# Altium project HU_revC.PrjPcb (part 3 of 4)

## Sheet MAX96724_PINOUT.SchDoc
size D; SheetNumber: 10; SheetTotal: 20
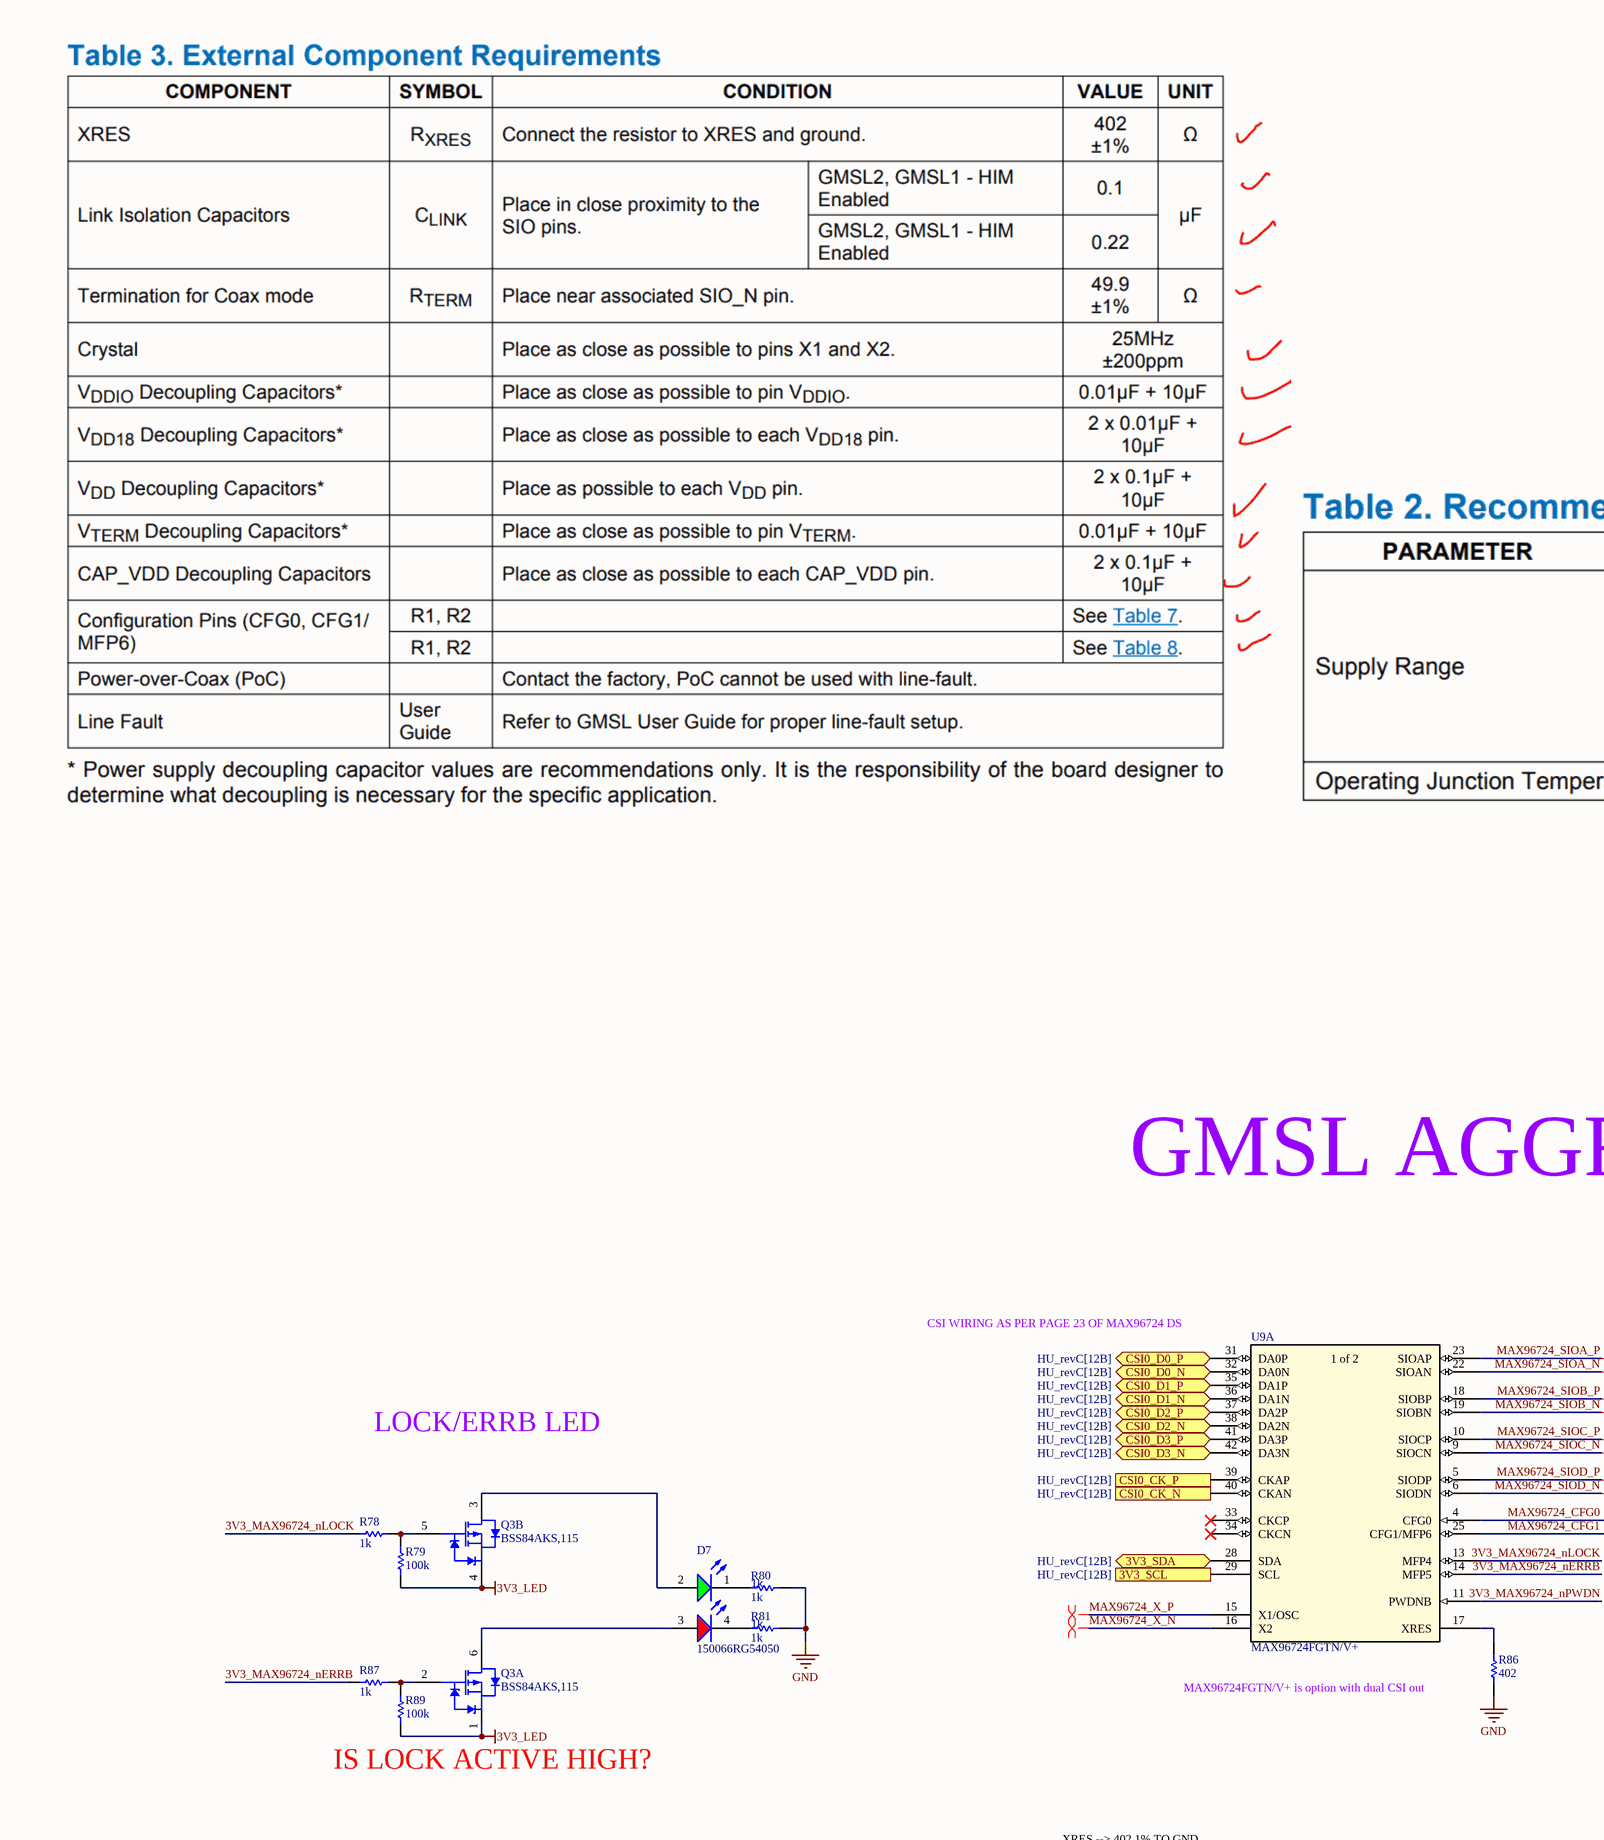
[diagram p13: MAX96724_PINOUT.SchDoc, top left]
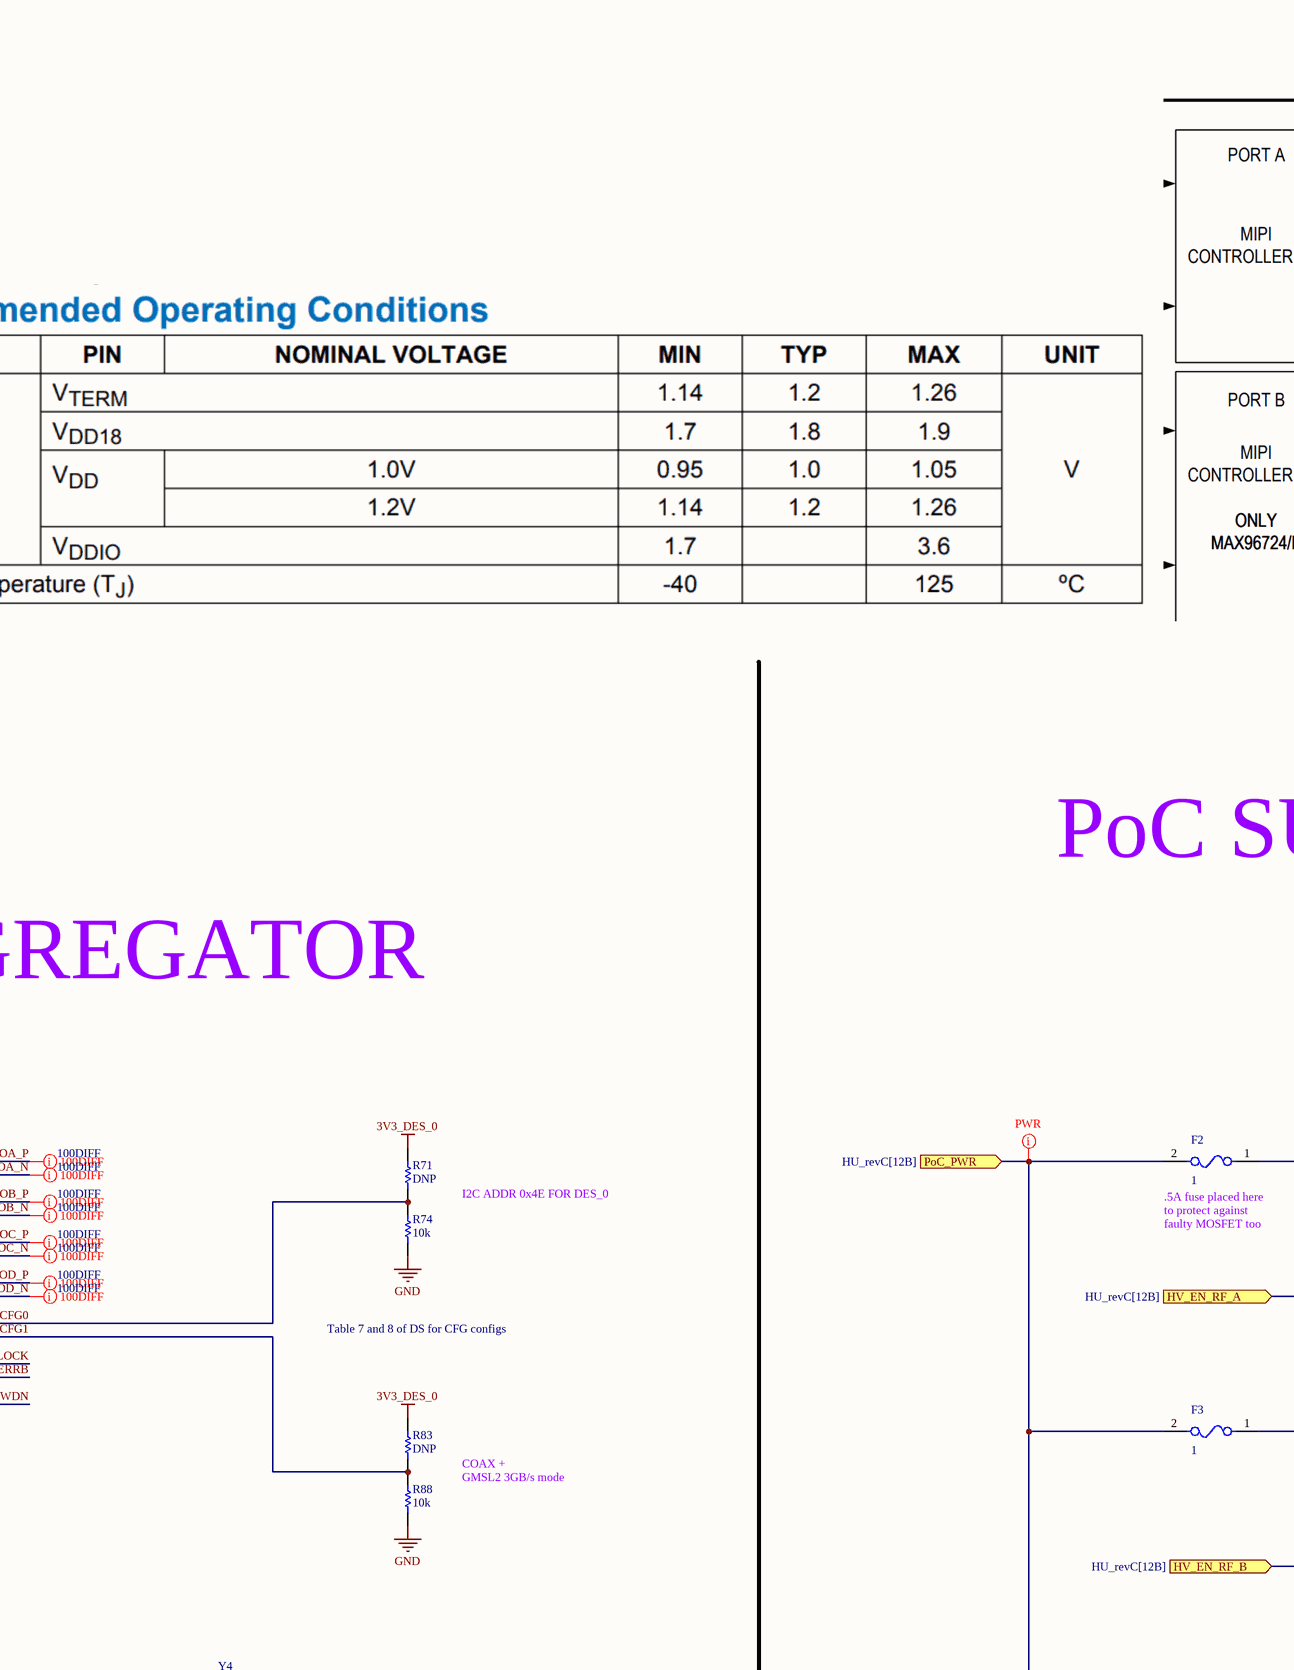
[diagram p14: MAX96724_PINOUT.SchDoc, top middle]
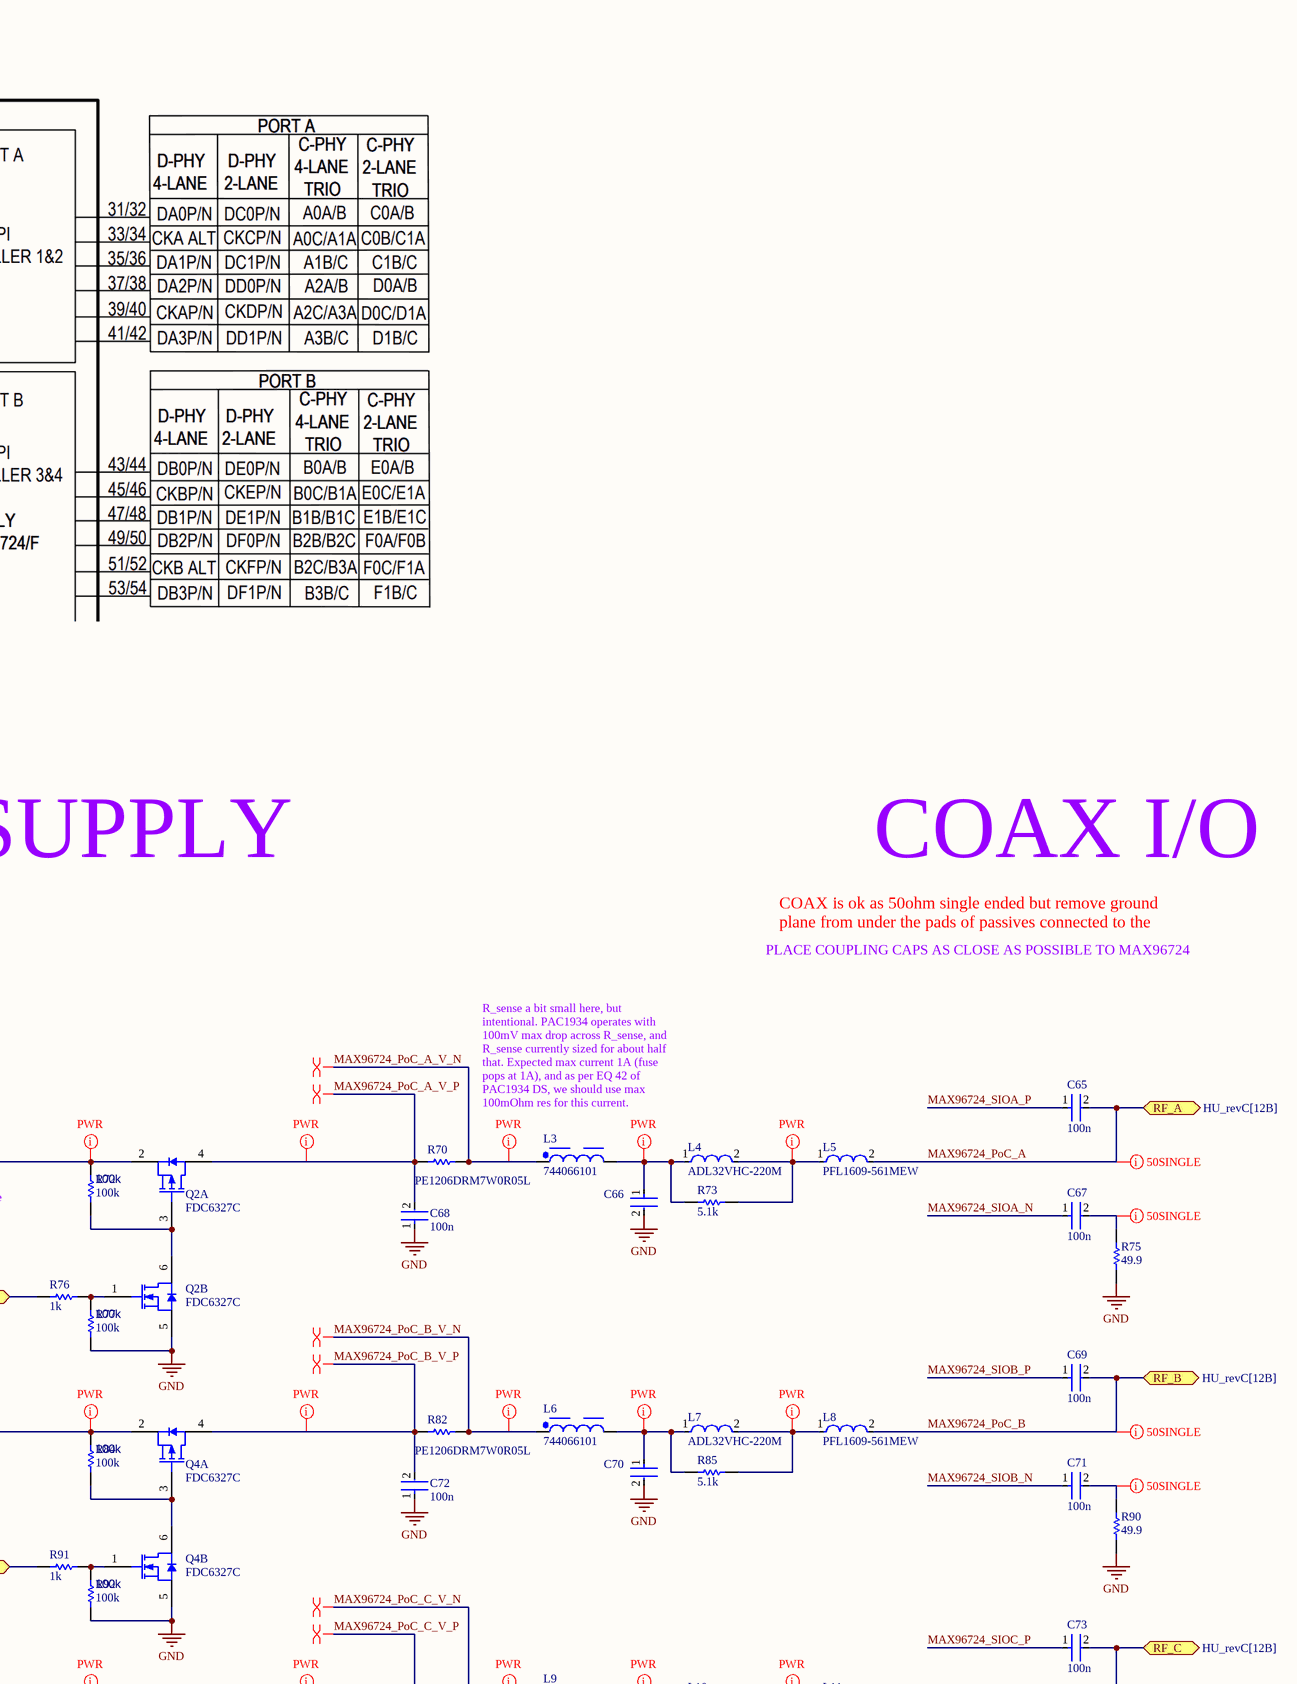
[diagram p15: MAX96724_PINOUT.SchDoc, top right]
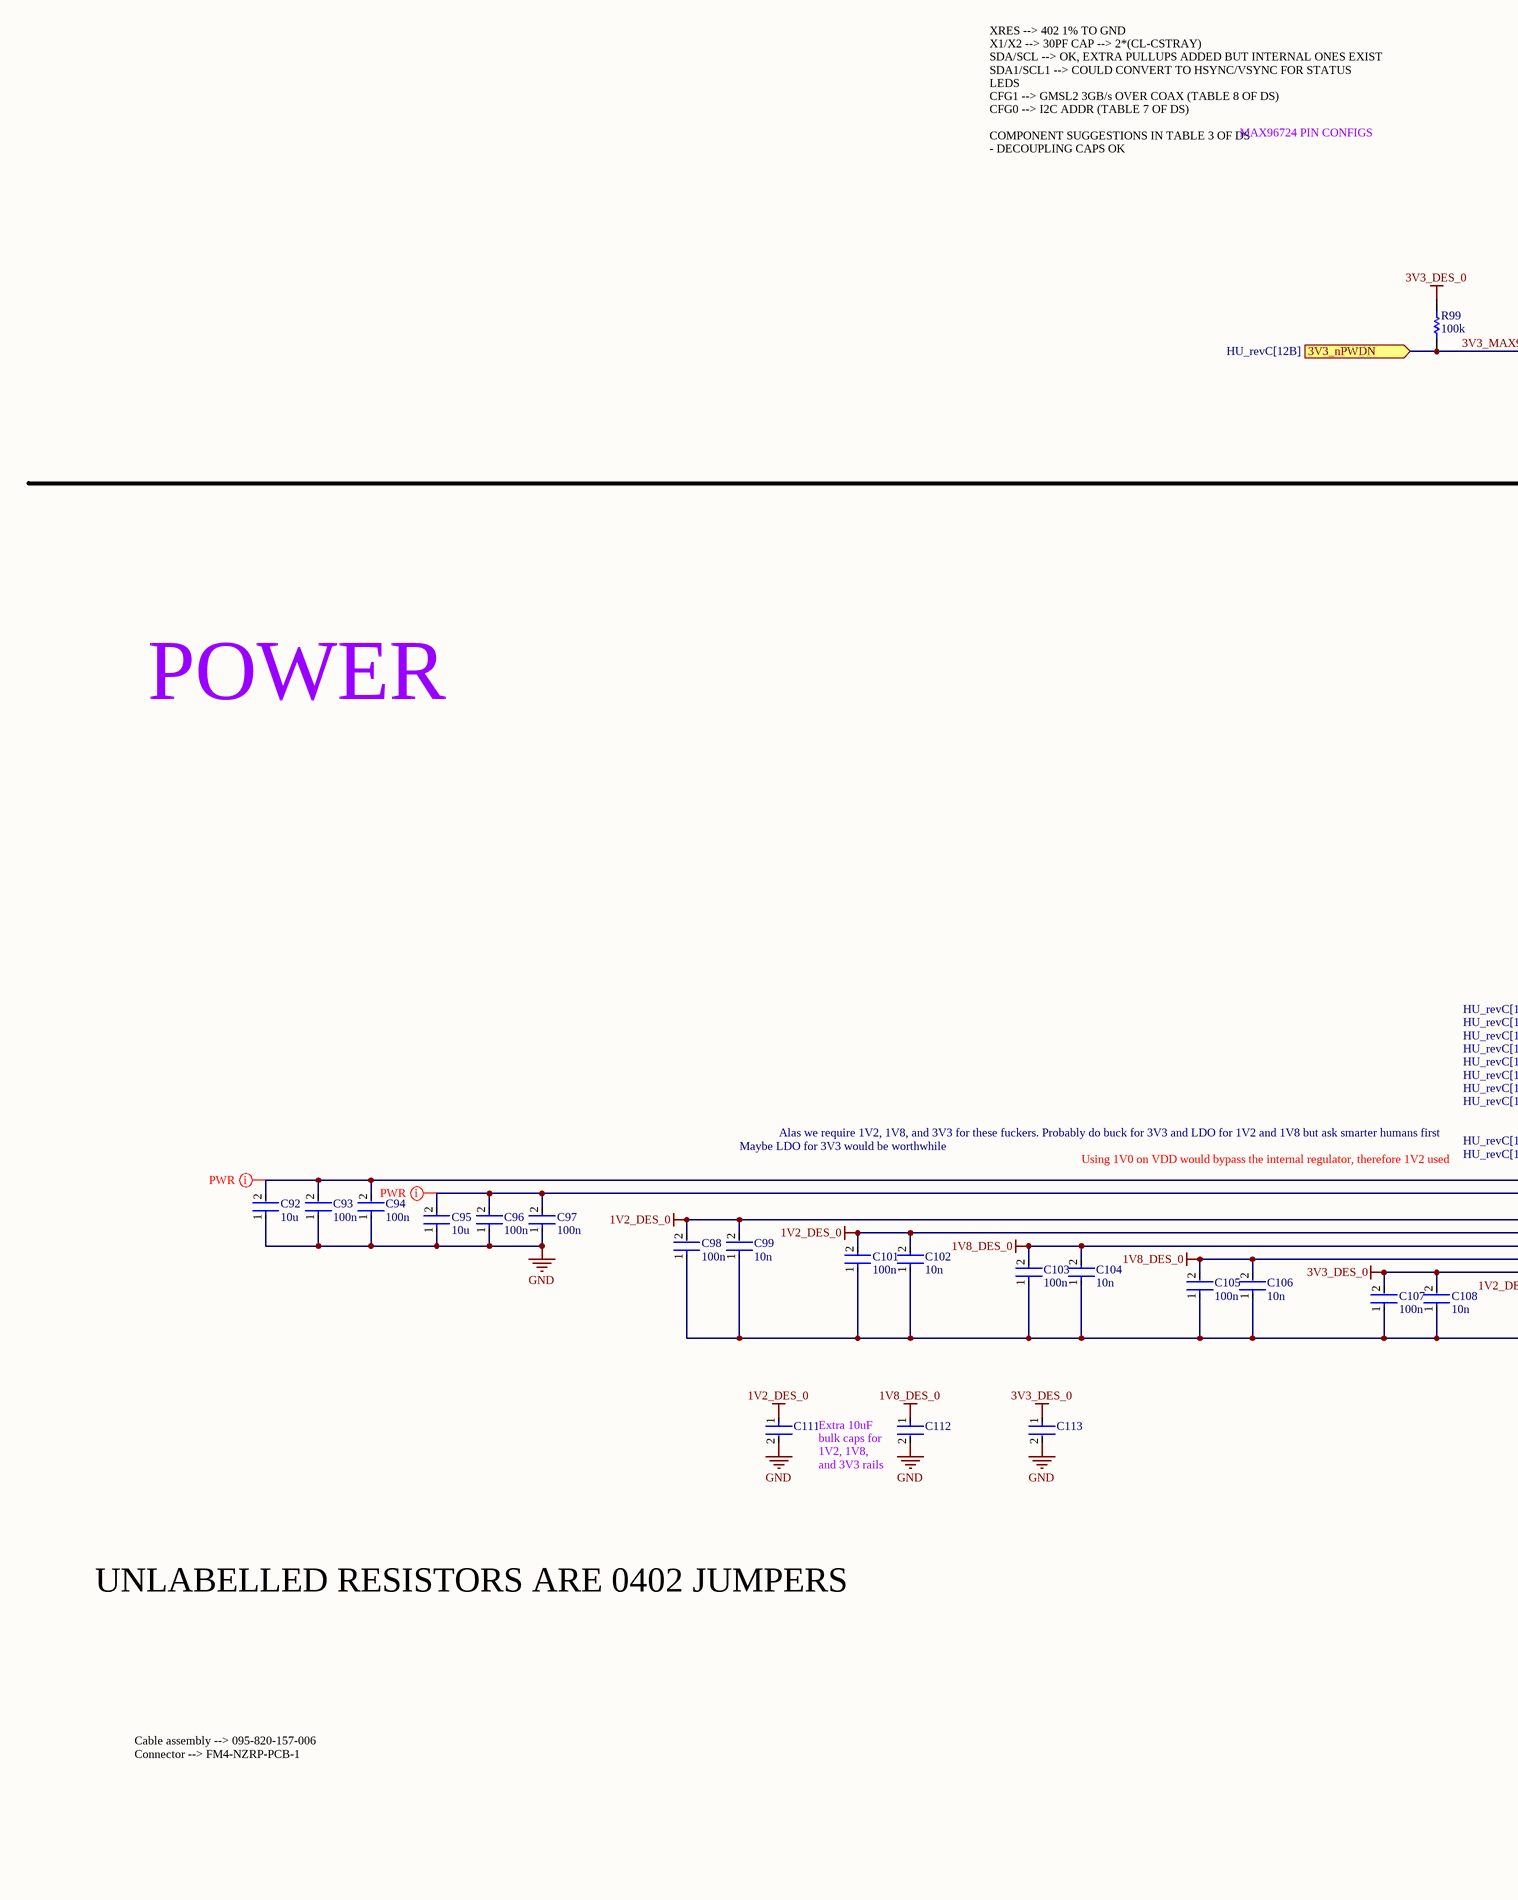
[diagram p16: MAX96724_PINOUT.SchDoc, bottom left]
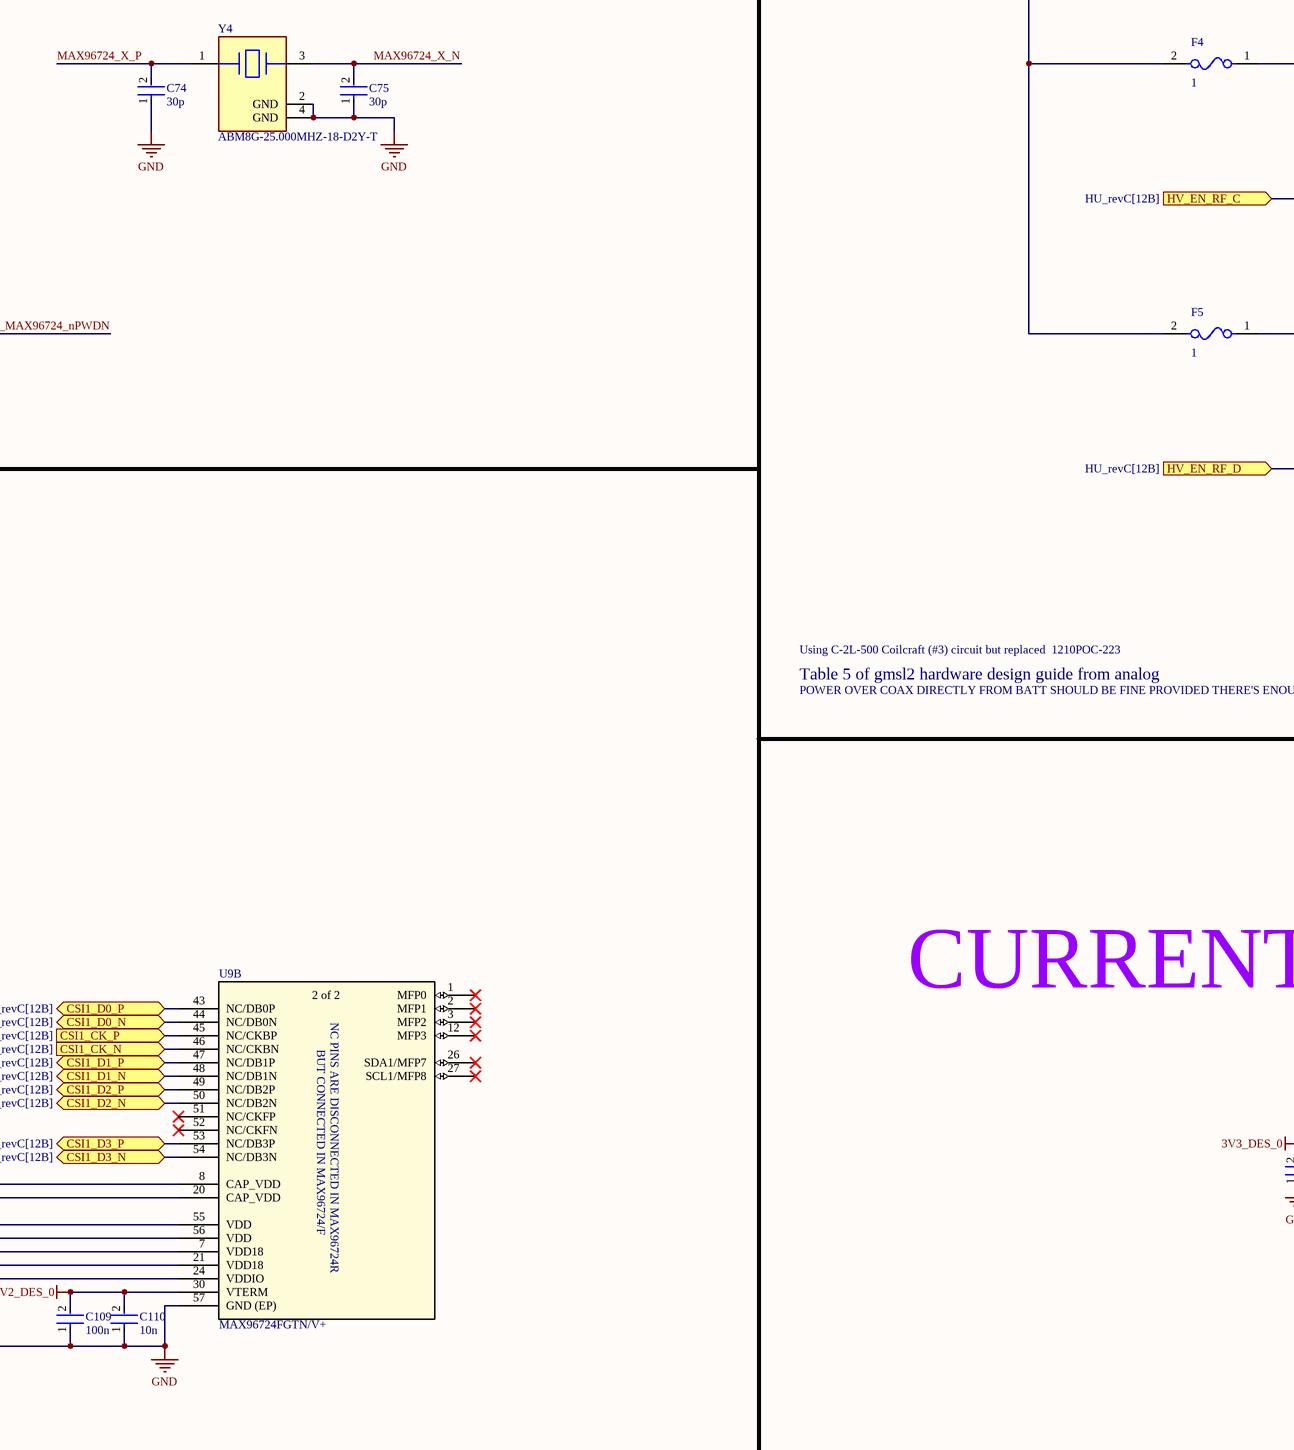
[diagram p17: MAX96724_PINOUT.SchDoc, bottom middle]
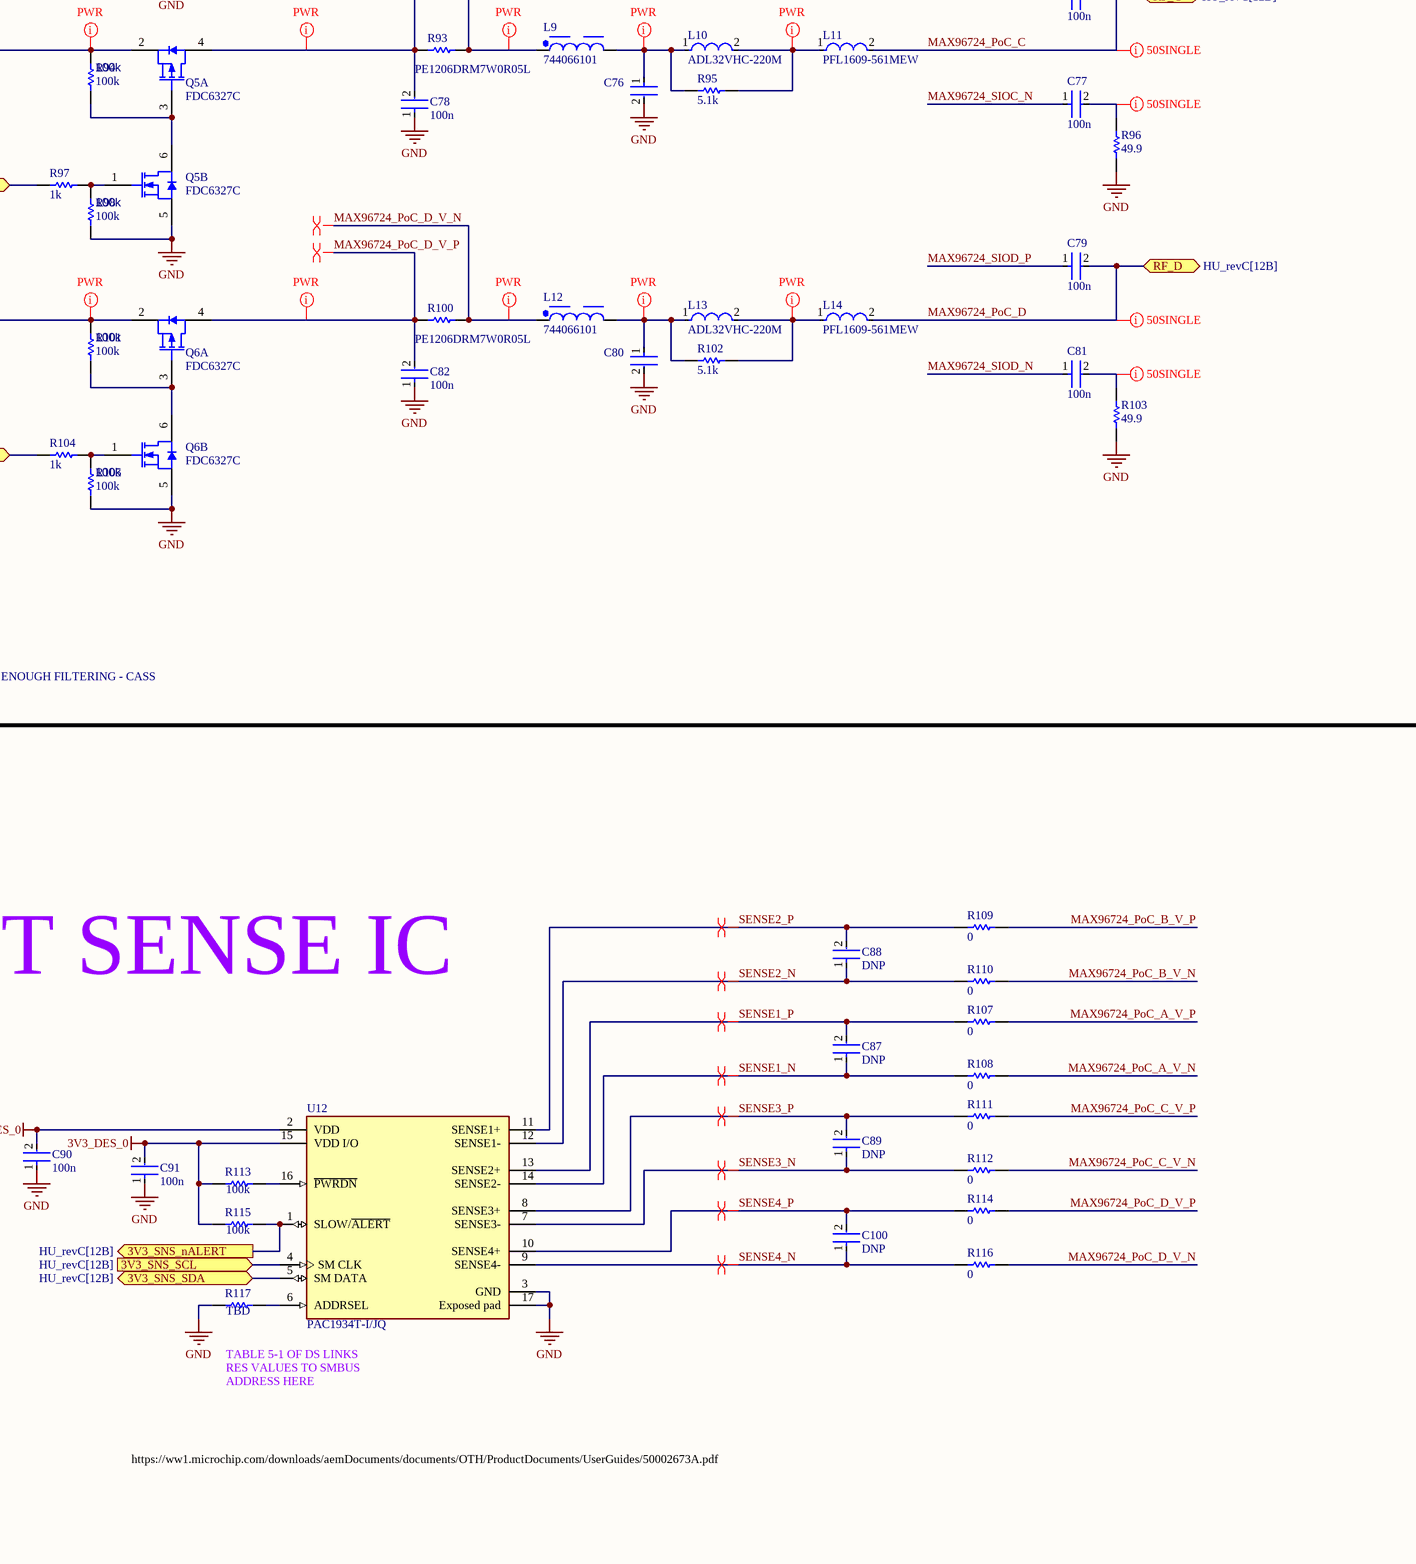
[diagram p18: MAX96724_PINOUT.SchDoc, bottom right]

### Parts
C65  100n  [FP-0402-L_1_0_0_05-W_0_5-IPC_A]
C66  GRM21BR61E226ME44L  [FP-GRM21B-0_2-e0_2_0_7-IPC_B]  (value not drawn)
C67  100n  [FP-0402-L_1_0_0_05-W_0_5-IPC_A]
C68  100n  [FP-0402-L_1_0_0_05-W_0_5-IPC_A]
C69  100n  [FP-0402-L_1_0_0_05-W_0_5-IPC_A]
C70  GRM21BR61E226ME44L  [FP-GRM21B-0_2-e0_2_0_7-IPC_B]  (value not drawn)
C71  100n  [FP-0402-L_1_0_0_05-W_0_5-IPC_A]
C72  100n  [FP-0402-L_1_0_0_05-W_0_5-IPC_A]
C73  100n  [FP-0402-L_1_0_0_05-W_0_5-IPC_A]
C74  30p  [FP-0402-L_1_0_0_05-W_0_5-IPC_A]
C75  30p  [FP-0402-L_1_0_0_05-W_0_5-IPC_A]
C76  GRM21BR61E226ME44L  [FP-GRM21B-0_2-e0_2_0_7-IPC_B]  (value not drawn)
C77  100n  [FP-0402-L_1_0_0_05-W_0_5-IPC_A]
C78  100n  [FP-0402-L_1_0_0_05-W_0_5-IPC_A]
C79  100n  [FP-0402-L_1_0_0_05-W_0_5-IPC_A]
C80  GRM21BR61E226ME44L  [FP-GRM21B-0_2-e0_2_0_7-IPC_B]  (value not drawn)
C81  100n  [FP-0402-L_1_0_0_05-W_0_5-IPC_A]
C82  100n  [FP-0402-L_1_0_0_05-W_0_5-IPC_A]
C87  DNP  [FP-0402-L_1_0_0_05-W_0_5-IPC_A]
C88  DNP  [FP-0402-L_1_0_0_05-W_0_5-IPC_A]
C89  DNP  [FP-0402-L_1_0_0_05-W_0_5-IPC_A]
C90  100n  [FP-0402-L_1_0_0_05-W_0_5-IPC_A]
C91  100n  [FP-0402-L_1_0_0_05-W_0_5-IPC_A]
C92  10u  [FP-0402-L_1_0_0_05-W_0_5-IPC_A]
C93  100n  [FP-0402-L_1_0_0_05-W_0_5-IPC_A]
C94  100n  [FP-0402-L_1_0_0_05-W_0_5-IPC_A]
C95  10u  [FP-0402-L_1_0_0_05-W_0_5-IPC_A]
C96  100n  [FP-0402-L_1_0_0_05-W_0_5-IPC_A]
C97  100n  [FP-0402-L_1_0_0_05-W_0_5-IPC_A]
C98  100n  [FP-0402-L_1_0_0_05-W_0_5-IPC_A]
C99  10n  [FP-0402-L_1_0_0_05-W_0_5-IPC_A]
C100  DNP  [FP-0402-L_1_0_0_05-W_0_5-IPC_A]
C101  100n  [FP-0402-L_1_0_0_05-W_0_5-IPC_A]
C102  10n  [FP-0402-L_1_0_0_05-W_0_5-IPC_A]
C103  100n  [FP-0402-L_1_0_0_05-W_0_5-IPC_A]
C104  10n  [FP-0402-L_1_0_0_05-W_0_5-IPC_A]
C105  100n  [FP-0402-L_1_0_0_05-W_0_5-IPC_A]
C106  10n  [FP-0402-L_1_0_0_05-W_0_5-IPC_A]
C107  100n  [FP-0402-L_1_0_0_05-W_0_5-IPC_A]
C108  10n  [FP-0402-L_1_0_0_05-W_0_5-IPC_A]
C109  100n  [FP-0402-L_1_0_0_05-W_0_5-IPC_A]
C110  10n  [FP-0402-L_1_0_0_05-W_0_5-IPC_A]
C111  EMK107BBJ106MA-T  [FP-0603-L_1_6_0_2-W_0_8_0-MFG]  (value not drawn)
C112  EMK107BBJ106MA-T  [FP-0603-L_1_6_0_2-W_0_8_0-MFG]  (value not drawn)
C113  EMK107BBJ106MA-T  [FP-0603-L_1_6_0_2-W_0_8_0-MFG]  (value not drawn)
D7  150066RG54050  [WL-SBCD_0606]
F2  1  [FP-0685T-MFG]
F3  1  [FP-0685T-MFG]
F4  1  [FP-0685T-MFG]
F5  1  [FP-0685T-MFG]
L3  744066101  [WE-TPC_1038]
L4  ADL32VHC-220M  [FP-1210POC-MFG]
L5  PFL1609-561MEW  [FP-PFL1609-MFG]
L6  744066101  [WE-TPC_1038]
L7  ADL32VHC-220M  [FP-1210POC-MFG]
L8  PFL1609-561MEW  [FP-PFL1609-MFG]
L9  744066101  [WE-TPC_1038]
L10  ADL32VHC-220M  [FP-1210POC-MFG]
L11  PFL1609-561MEW  [FP-PFL1609-MFG]
L12  744066101  [WE-TPC_1038]
L13  ADL32VHC-220M  [FP-1210POC-MFG]
L14  PFL1609-561MEW  [FP-PFL1609-MFG]
Q2  FDC6327C  [FAIR-SOT23-6_V]  (parts A,B of 2)
Q3  BSS84AKS,115  [NXP-SOT363_L]  (parts A,B of 2)
Q4  FDC6327C  [FAIR-SOT23-6_V]  (parts A,B of 2)
Q5  FDC6327C  [FAIR-SOT23-6_V]  (parts A,B of 2)
Q6  FDC6327C  [FAIR-SOT23-6_V]  (parts A,B of 2)
R70  PE1206DRM7W0R05L  [R1206B]
R71  DNP  [R0603B]
R72  100k  [R0603B]
R73  5.1k  [R0603B]
R74  10k  [R0603B]
R75  49.9  [R0603B]
R76  1k  [R0603B]
R77  100k  [R0603B]
R78  1k  [R0603B]
R79  100k  [R0603B]
R80  1k  [R0603B]
R81  1k  [R0603B]
R82  PE1206DRM7W0R05L  [R1206B]
R83  DNP  [R0603B]
R84  100k  [R0603B]
R85  5.1k  [R0603B]
R86  402  [R0603B]
R87  1k  [R0603B]
R88  10k  [R0603B]
R89  100k  [R0603B]
R90  49.9  [R0603B]
R91  1k  [R0603B]
R92  100k  [R0603B]
R93  PE1206DRM7W0R05L  [R1206B]
R94  100k  [R0603B]
R95  5.1k  [R0603B]
R96  49.9  [R0603B]
R97  1k  [R0603B]
R98  100k  [R0603B]
R99  100k  [R0603B]
R100  PE1206DRM7W0R05L  [R1206B]
R101  100k  [R0603B]
R102  5.1k  [R0603B]
R103  49.9  [R0603B]
R104  1k  [R0603B]
R105  100k  [R0603B]
R107  0  [R0603B]
R108  0  [R0603B]
R109  0  [R0603B]
R110  0  [R0603B]
R111  0  [R0603B]
R112  0  [R0603B]
R113  100k  [R0603B]
R114  0  [R0603B]
R115  100k  [R0603B]
R116  0  [R0603B]
R117  TBD  [R0603B]
U9  MAX96724FGTN/V+  [MAX96724FGTN_V+-Footprint-1]  (parts A,B of 2)
U12  PAC1934T-I/JQ  [FP-C04-257-MFG]
Y4  ABM8G-25.000MHZ-18-D2Y-T  [FP-ABM8G-MFG]

### Ports
3V3_nPWDN (in, see HU_revC[12B]), 3V3_SCL (in, see HU_revC[12B]), 3V3_SDA (bidir, see HU_revC[12B]), 3V3_SNS_nALERT (out, see HU_revC[12B]), 3V3_SNS_SCL (in, see HU_revC[12B]), 3V3_SNS_SDA (bidir, see HU_revC[12B]), CSI0_CK_N (in, see HU_revC[12B]), CSI0_CK_P (in, see HU_revC[12B]), CSI0_D0_N (bidir, see HU_revC[12B]), CSI0_D0_P (bidir, see HU_revC[12B]), CSI0_D1_N (bidir, see HU_revC[12B]), CSI0_D1_P (bidir, see HU_revC[12B]), CSI0_D2_N (bidir, see HU_revC[12B]), CSI0_D2_P (bidir, see HU_revC[12B]), CSI0_D3_N (bidir, see HU_revC[12B]), CSI0_D3_P (bidir, see HU_revC[12B]), CSI1_CK_N (in, see HU_revC[12B]), CSI1_CK_P (in, see HU_revC[12B]), CSI1_D0_N (bidir, see HU_revC[12B]), CSI1_D0_P (bidir, see HU_revC[12B]), CSI1_D1_N (bidir, see HU_revC[12B]), CSI1_D1_P (bidir, see HU_revC[12B]), CSI1_D2_N (bidir, see HU_revC[12B]), CSI1_D2_P (bidir, see HU_revC[12B]), CSI1_D3_N (bidir, see HU_revC[12B]), CSI1_D3_P (bidir, see HU_revC[12B]), HV_EN_RF_A (in, see HU_revC[12B]), HV_EN_RF_B (in, see HU_revC[12B]), HV_EN_RF_C (in, see HU_revC[12B]), HV_EN_RF_D (in, see HU_revC[12B]), PoC_PWR (in, see HU_revC[12B]), RF_A (bidir, see HU_revC[12B]), RF_B (bidir, see HU_revC[12B]), RF_C (bidir, see HU_revC[12B]), RF_D (bidir, see HU_revC[12B])

### Nets
1V2_DES_0: C98.2 C99.2 C101.2 C102.2 C109.2 C110.2 C111.1 U9.30(VTERM) U9.55(VDD) U9.56(VDD)
1V8_DES_0: C103.2 C104.2 C105.2 C106.2 C112.1 U9.7(VDD18) U9.21(VDD18)
3V3_DES_0: C90.2 C91.2 C107.2 C108.2 C113.1 R71.2 R83.2 R99.2 R113.2 R115.2 U9.24(VDDIO) U12.2(VDD) U12.15(VDD_I/O)
3V3_LED: Q3.1(S1) Q3.4(S2) R79.2 R89.1
12V0_PoC: F2.2 F3.2 F4.2 F5.2 ; port PoC_PWR
GND: C66.2 C68.1 C70.2 C72.1 C74.1 C75.1 C76.2 C78.1 C80.2 C82.1 C90.1 C91.1 C92.1 C93.1 C94.1 C95.1 C96.1 C97.1 C98.1 C99.1 C101.1 C102.1 C103.1 C104.1 C105.1 C106.1 C107.1 C108.1 C109.1 C110.1 C111.2 C112.2 C113.2 Q2.5(S) Q4.5(S) Q5.5(S) Q6.5(S) R74.1 R75.1 R77.1 R80.1 R81.1 R86.1 R88.1 R90.1 R92.1 R96.1 R98.1 R103.1 R105.1 R117.2 U9.57(GND_(EP)) U12.3(GND) U12.17(Exposed_pad) Y4.2(GND) Y4.4(GND)
3V3_I2C0_SCL: U9.29(SCL) U12.4(SM_CLK) ; port 3V3_SNS_SCL, port 3V3_SCL
3V3_I2C0_SDA: U9.28(SDA) U12.5(SM_DATA) ; port 3V3_SNS_SDA, port 3V3_SDA
3V3_MAX96724_0_EN_RF_A: R76.2 ; port HV_EN_RF_A
3V3_MAX96724_0_EN_RF_B: R91.2 ; port HV_EN_RF_B
3V3_MAX96724_0_EN_RF_C: R97.2 ; port HV_EN_RF_C
3V3_MAX96724_0_EN_RF_D: R104.2 ; port HV_EN_RF_D
3V3_MAX96724_nERRB: R87.1 U9.14(MFP5)
3V3_MAX96724_nLOCK: R78.2 U9.13(MFP4)
3V3_MAX96724_nPWDN: R99.1 U9.11(PWDNB) ; port 3V3_nPWDN  [project net 3V3_CAM_GPIO0]
DPHY0_CK_N: U9.40(CKAN) ; port CSI0_CK_N
DPHY0_CK_P: U9.39(CKAP) ; port CSI0_CK_P
DPHY0_D0_N: U9.32(DA0N) ; port CSI0_D0_N
DPHY0_D0_P: U9.31(DA0P) ; port CSI0_D0_P
DPHY0_D1_N: U9.36(DA1N) ; port CSI0_D1_N
DPHY0_D1_P: U9.35(DA1P) ; port CSI0_D1_P
DPHY0_D2_N: U9.38(DA2N) ; port CSI0_D2_N
DPHY0_D2_P: U9.37(DA2P) ; port CSI0_D2_P
DPHY0_D3_N: U9.42(DA3N) ; port CSI0_D3_N
DPHY0_D3_P: U9.41(DA3P) ; port CSI0_D3_P
DPHY1_CK_N: U9.46(NC/CKBN) ; port CSI1_CK_N
DPHY1_CK_P: U9.45(NC/CKBP) ; port CSI1_CK_P
DPHY1_D0_N: U9.44(NC/DB0N) ; port CSI1_D0_N
DPHY1_D0_P: U9.43(NC/DB0P) ; port CSI1_D0_P
DPHY1_D1_N: U9.48(NC/DB1N) ; port CSI1_D1_N
DPHY1_D1_P: U9.47(NC/DB1P) ; port CSI1_D1_P
DPHY1_D2_N: U9.50(NC/DB2N) ; port CSI1_D2_N
DPHY1_D2_P: U9.49(NC/DB2P) ; port CSI1_D2_P
DPHY1_D3_N: U9.54(NC/DB3N) ; port CSI1_D3_N
DPHY1_D3_P: U9.53(NC/DB3P) ; port CSI1_D3_P
MAX96724_CFG0: R71.1 R74.2 U9.4(CFG0)
MAX96724_CFG1: R83.1 R88.2 U9.25(CFG1/MFP6)
MAX96724_PoC_A: C65.2 L5.2 ; port RF_A
MAX96724_PoC_A_V_N: L3.1 R70.1 R108.1
MAX96724_PoC_A_V_P: C68.2 Q2.4(D) R70.2 R107.1
MAX96724_PoC_B: C69.2 L8.2 ; port RF_B
MAX96724_PoC_B_V_N: L6.1 R82.1 R110.1
MAX96724_PoC_B_V_P: C72.2 Q4.4(D) R82.2 R109.1
MAX96724_PoC_C: C73.2 L11.2 ; port RF_C
MAX96724_PoC_C_V_N: L9.1 R93.1 R112.1
MAX96724_PoC_C_V_P: C78.2 Q5.4(D) R93.2 R111.1
MAX96724_PoC_D: C79.2 L14.2 ; port RF_D
MAX96724_PoC_D_V_N: L12.1 R100.1 R116.1
MAX96724_PoC_D_V_P: C82.2 Q6.4(D) R100.2 R114.1
MAX96724_SIOA_N: C67.1 U9.22(SIOAN)
MAX96724_SIOA_P: C65.1 U9.23(SIOAP)
MAX96724_SIOB_N: C71.1 U9.19(SIOBN)
MAX96724_SIOB_P: C69.1 U9.18(SIOBP)
MAX96724_SIOC_N: C77.1 U9.9(SIOCN)
MAX96724_SIOC_P: C73.1 U9.10(SIOCP)
MAX96724_SIOD_N: C81.1 U9.6(SIODN)
MAX96724_SIOD_P: C79.1 U9.5(SIODP)
MAX96724_X_N: C75.2 U9.16(X2) Y4.3
MAX96724_X_P: C74.2 U9.15(X1/OSC) Y4.1
SENSE1_N: C87.1 R108.2 U12.14(SENSE2-)
SENSE1_P: C87.2 R107.2 U12.13(SENSE2+)
SENSE2_N: C88.1 R110.2 U12.12(SENSE1-)
SENSE2_P: C88.2 R109.2 U12.11(SENSE1+)
SENSE3_N: C89.1 R112.2 U12.7(SENSE3-)
SENSE3_P: C89.2 R111.2 U12.8(SENSE3+)
SENSE4_N: C100.1 R116.2 U12.9(SENSE4-)
SENSE4_P: C100.2 R114.2 U12.10(SENSE4+)
NetC66_1: C66.1 L3.2 L4.1 R73.2
NetC67_2: C67.2 R75.2
NetC70_1: C70.1 L6.2 L7.1 R85.2
NetC71_2: C71.2 R90.2
NetC76_1: C76.1 L9.2 L10.1 R95.2
NetC77_2: C77.2 R96.2
NetC80_1: C80.1 L12.2 L13.1 R102.2
NetC81_2: C81.2 R103.2
NetC92_2: C92.2 C93.2 C94.2 U9.8(CAP_VDD)
NetC95_2: C95.2 C96.2 C97.2 U9.20(CAP_VDD)
NetD7_1: D7.1(K) R80.2
NetD7_2: D7.2(A) Q3.3(D2)
NetD7_3: D7.3(A) Q3.6(D1)
NetD7_4: D7.4(K) R81.2
NetF2_1: F2.1 Q2.2(S) R72.2
NetF3_1: F3.1 Q4.2(S) R84.2
NetF4_1: F4.1 Q5.2(S) R94.2
NetF5_1: F5.1 Q6.2(S) R101.2
NetL4_2: L4.2 L5.1 R73.1
NetL7_2: L7.2 L8.1 R85.1
NetL10_2: L10.2 L11.1 R95.1
NetL13_2: L13.2 L14.1 R102.1
NetQ2_1: Q2.1(G) R76.1 R77.2
NetQ2_3: Q2.3(G) Q2.6(D) R72.1
NetQ3_2: Q3.2(G1) R87.2 R89.2
NetQ3_5: Q3.5(G2) R78.1 R79.1
NetQ4_1: Q4.1(G) R91.1 R92.2
NetQ4_3: Q4.3(G) Q4.6(D) R84.1
NetQ5_1: Q5.1(G) R97.1 R98.2
NetQ5_3: Q5.3(G) Q5.6(D) R94.1
NetQ6_1: Q6.1(G) R104.1 R105.2
NetQ6_3: Q6.3(G) Q6.6(D) R101.1
NetR86_2: R86.2 U9.17(XRES)
NetR113_1: R113.1 U12.16(~{PWRDN})
NetR115_1: R115.1 U12.1(SLOW/~{ALERT}) ; port 3V3_SNS_nALERT
NetR117_1: R117.1 U12.6(ADDRSEL)

Not connected (* = marked no-connect by the designer): U9 1(MFP0)* 2(MFP1)* 3(MFP2)* 12(MFP3)* 26(SDA1/MFP7)* 27(SCL1/MFP8)* 33(CKCP)* 34(CKCN)* 51(NC/CKFP)* 52(NC/CKFN)*

### Layout directives
net class 50SINGLE: MAX96724_PoC_A, MAX96724_PoC_B, MAX96724_PoC_C, MAX96724_PoC_D, NetC67_2, NetC71_2, NetC77_2, NetC81_2
differential pair: MAX96724_PoC_A_V_N, MAX96724_PoC_A_V_P, MAX96724_PoC_B_V_N, MAX96724_PoC_B_V_P, MAX96724_PoC_C_V_N, MAX96724_PoC_C_V_P, MAX96724_PoC_D_V_N, MAX96724_PoC_D_V_P, MAX96724_X_N, MAX96724_X_P, SENSE1_N, SENSE1_P, SENSE2_N, SENSE2_P, SENSE3_N, SENSE3_P, SENSE4_N, SENSE4_P
net class PWR: 12V0_PoC, MAX96724_PoC_A_V_N, MAX96724_PoC_A_V_P, MAX96724_PoC_B_V_N, MAX96724_PoC_B_V_P, MAX96724_PoC_C_V_N, MAX96724_PoC_C_V_P, MAX96724_PoC_D_V_N, MAX96724_PoC_D_V_P, NetC66_1, NetC70_1, NetC76_1, NetC80_1, NetC92_2, NetC95_2, NetF2_1, NetF3_1, NetF4_1, NetF5_1, NetL4_2, NetL7_2, NetL10_2, NetL13_2
differential pair; differential pair class 100DIFF: MAX96724_SIOA_N, MAX96724_SIOA_P, MAX96724_SIOB_N, MAX96724_SIOB_P, MAX96724_SIOC_N, MAX96724_SIOC_P, MAX96724_SIOD_N, MAX96724_SIOD_P

### Notes on the sheet
- PoC SUPPLY
- COAX I/O
- PLACE COUPLING CAPS AS CLOSE AS POSSIBLE TO MAX96724
- COAX is ok as 50ohm single ended but remove ground plane from under the pads of passives connected to the GMSL trace
- GMSL AGGREGATOR
- R_sense a bit small here, but intentional. PAC1934 operates with 100mV max drop across R_sense, and R_sense currently sized for about half that. Expected max current 1A (fuse pops at 1A), and as per EQ 42 of PAC1934 DS, we should use max 100mOhm res for this current.
- CSI WIRING AS PER PAGE 23 OF MAX96724 DS
- LOCK/ERRB LED
- I2C ADDR 0x4E FOR DES_0
- (near F2) .5A fuse placed here to protect against faulty MOSFET too
- Table 7 and 8 of DS for CFG configs
- MAX96724FGTN/V+ is option with dual CSI out
- GMSL2 3GB/s mode
- COAX +
- IS LOCK ACTIVE HIGH?
- XRES --> 402 1% TO GND
  X1/X2 --> 30PF CAP --> 2*(CL-CSTRAY)
  SDA/SCL --> OK, EXTRA PULLUPS ADDED BUT INTERNAL ONES EXIST
  SDA1/SCL1 --> COULD CONVERT TO HSYNC/VSYNC FOR STATUS LEDS
  CFG1 --> GMSL2 3GB/s OVER COAX (TABLE 8 OF DS)
  CFG0 --> I2C ADDR (TABLE 7 OF DS)
  COMPONENT SUGGESTIONS IN TABLE 3 OF DS
  - DECOUPLING CAPS OK
- MAX96724 PIN CONFIGS
- Table 5 of gmsl2 hardware design guide from analog
- POWER OVER COAX DIRECTLY FROM BATT SHOULD BE FINE PROVIDED THERE'S ENOUGH FILTERING - CASS
- Using C-2L-500 Coilcraft (#3) circuit but replaced  1210POC-223
- POWER
- CURRENT SENSE IC
- Maybe LDO for 3V3 would be worthwhile
- Alas we require 1V2, 1V8, and 3V3 for these fuckers. Probably do buck for 3V3 and LDO for 1V2 and 1V8 but ask smarter humans first
- Using 1V0 on VDD would bypass the internal regulator, therefore 1V2 used
- TABLE 5-1 OF DS LINKS RES VALUES TO SMBUS ADDRESS HERE
- Extra 10uF bulk caps for 1V2, 1V8, and 3V3 rails
- https://ww1.microchip.com/downloads/aemDocuments/documents/OTH/ProductDocuments/UserGuides/50002673A.pdf
- UNLABELLED RESISTORS ARE 0402 JUMPERS
- Cable assembly --> 095-820-157-006
  Connector --> FM4-NZRP-PCB-1
- (in symbol CMP-015-00011-4, part A) 1 of 2
- (in symbol CMP-015-00011-4, part B) 2 of 2; NC PINS ARE DISCONNECTED IN MAX96724R; BUT CONNECTED IN MAX96724/F

### Library data of the parts
C65 C67-C69 C71-C75 C77-C79 C81 C82 C87-C110 = CMP-001-00058-1: LARGE PADS, 0402 CAP, CHANGE COMMENT TO MATCH REAL P/N; Capacitor Type: Ceramic; Min Operating Temperature: -55°C; Mounting Technology: Surface Mount; Pins: 2; Case/Package: 0402; RoHS Compliant: Yes; Max Operating Temperature: 85°C
C66 C70 C76 C80 = CMP-2007-03222-3: Chip Multilayer Ceramic Capacitors for General Purpose, 0805, 22uF, X5R, 15%, 20%, 25V; Case/Package: 0805; Depth: 1.25mm; Resistor Type: Ceramic; Voltage Rating: 25V; Lead Free: Lead Free; Voltage Rating (DC): 25V; Case Code (Metric): 2012; Thickness: 0.057inch; REACH SVHC: No SVHC; Material: Ceramic; Tolerance: 20%; Length: 2mm; Capacitance: 22uF; Case Code (Imperial): 0805; Max Operating Temperature: 85°C; Termination: SMD/SMT; Weight: 0.000335oz; Dielectric: X5R; Packaging: Tape and Reel; Voltage: 25V; Package Quantity: 3000; Height: 1.25mm; Mount: Surface Mount; Width: 1.25mm; Min Operating Temperature: -55°C
C111-C113 = CMP-2000-06226-4: Multilayer Ceramic Capacitor 10uF 16V X5R 20% SMD 0603 T/R; Packaging: Tape and Reel; Construction: Flat; Height: 0.8mm; Max Operating Temperature: 85°C; Dielectric: X5R; Case Code (Metric): 1608; Voltage Rating (DC): 16V; Width: 0.031inch; Voltage Rating: 16V; Length: 0.063inch; RoHS Compliant: Yes; Halogen Free: Halogen Free; Case Code (Imperial): 0603; Capacitance: 10uF; Mount: Surface Mount; Thickness: 0.031inch; Tolerance: 20%; Min Operating Temperature: -55°C; Series: M; Termination: SMD/SMT; Case/Package: 0603; Package Quantity: 1
D7 = CMP-004-00040-2: Led, Red/Grn, 180Mcd/230Mcd, 624Nm/525Nm Rohs Compliant: Yes; Source: rgled.SchLib; Component Type: Standard; Design Item ID: CMP-004-00034-2; Pins: 4
F2-F5 = CMP-16042-000006-1: FUSE BOARD MNT 5A 63VAC/VDC 1206; RoHS Compliant: Yes
L3 L6 L9 L12 = CMP-0227-00094-3: NexarPartId: 8917123; Current Rating: 1.2A; Shielding: Shielded; Core Material: Ferrite; Inductance: 100µH; Test Frequency: 100kHz; Tolerance: 30%; Resistance: 255mΩ; Self Resonant Frequency: 6MHz; Composition: Wirewound; Packaging: Cut Tape (CT); REACH SVHC: Unknown; Number of Pins: 2; Max DC Current: 1.2A; Saturation Current: 1.2A; Ambient Temperature Range High: 95°C; Weight: 1.273007g; Height: 3.8mm; Width: 10mm; Min Operating Temperature: -40°C; Max Operating Temperature: 125°C; Termination: SMD/SMT; Height - Seated (Max): 4.0894mm; Length: 10mm; RMS Current (Irms): 1.2A; Ambient Temperature Range Low: -40°C; RoHS: Compliant; Mount: Surface Mount; Depth: 10mm; DC Resistance (DCR): 255mΩ; Inductance Tolerance: 30%; Case/Package: Nonstandard
L4 L7 L10 L13 = CMP-11268-000041-1: NOT COILCRAFT - ACTUAL P# --> ADL32VHC-220M / - Power Injection Chokes for PoC; Manufacturer Part Number: 1210POC-223MRC; Value: 22uH; Core Material: Ferrite; Saturation Current: 720mA; Series Resistance: 0.88Ω; Rms Current: 700mA; Automotive Grade: Grade 1; Self Resonant Frequency: 70MHz; Test Frequency: 100kHz; Tolerance: 20%; Ambient Temperature Range High: +125°C; Manufacturer: coilcraft; Octopart: https://octopart.com/1210poc-223mrc-coilcraft-103207315; Category: Ind; Device Class L2: Inductors; RoHS: TRUE; Device Class L3: Fixed Inductors; Package: 1210POC; Ambient Temperature Range Low: -40°C; ComponentLink2URL: https://drive.google.com/open?id=15FlOq8Y4YbRFohfA_cJ40jgnqs8va2Mh; Lead Free: Yes; Inductance: 22uH; Device Class L1: Passive Components; ComponentLink2Description: Datasheet; Automotive: Yes; Height: 3mm
L5 L8 L11 L14 = CMP-11268-000007-1: Fixed Inductors PFL1609 Low Profile 0.56 uH 20 % 1.4 A; Manufacturer: coilcraft; Rms Current: 1100mA; Self Resonant Frequency: 600MHz; Core Material: Composite; Tolerance: 20%; Value: 0.56uH; Automotive Grade: Grade 1; Saturation Current: 710mA; Test Frequency: 7.9MHz; Shielding: true; Series Resistance: 130mΩ; Lead Free: Yes; Device Class L1: Passive Components; Package: PFL1609; Octopart: https://octopart.com/pfl1609-561mew-coilcraft-20329171; ComponentLink2URL: https://www.coilcraft.com/pdfs/pfl1609.pdf; Manufacturer Part Number: PFL1609-561MEW; Ambient Temperature Range Low: -40°C; Composition: Wirewound; Inductance: 0.56uH; Device Class L2: Inductors; Category: Ind; Device Class L3: Fixed Inductors; Mouser Description: Fixed Inductors PFL1609 Low Profile 0.56 uH 20 % 1.4 A; Automotive: Yes; ComponentLink2Description: Datasheet; Ambient Temperature Range High: +105°C; Height: 0.95mm; RoHS: TRUE
Q2 Q4-Q6 = CMP-2000-04939-1: Dual N & P-Channel 2.5 V Specified PowerTrench(TM) MOSFET, -55 to 150 degC, 6-Pin SOT-23, RoHS, Tape and Reel; Manufacturer: Fairchild; Typical Rise Time: 9@NChannel; Rad Hard: No; Maximum Drain Source Voltage: 20V; Typical Fall Time: 3@NChannel; Typical Turn-On Delay Time: 5@NChannel; Maximum Continuous Drain Current: 2.7@NChannel; Typical Turn-Off Delay Time: 12@NChannel; RDS-on: 80@4.5V@NChannel; Channel Mode: Enhancement; Maximum Gate Source Voltage: ±8V; Package Version: Rev. 5, 05/2015; Operating Temperature: -55to150degC; Packaging: Tape&Reel; Package Reference: SOT23-6; Package URL: https://www.fairchildsemi.com/package-drawings/MA/MA06A.pdf; Package Description: 6-Pin Small Outline Transistor, Body 2.9 x 1.6 mm, Pitch 0.95 mm; Manufacturer URL: https://www.fairchildsemi.com/; Channel Type: N; Datasheet Version: Rev. E, 07/2000; Package: 6SuperSOT; Datasheet URL: https://www.fairchildsemi.com/datasheets/FD/FDC6327C.pdf; Mounting: SurfaceMount; Category: MOSFET
Q3 = CMP-1259-00116-1: Dual P-Channel Trench MOSFET, -50 V, -0.16 A, -55 to 150 degC, 6-Pin SOT363, Tape and Reel; Manufacturer: NXP Semiconductors; VGSth [typ] (V): -1.6; Automotive Qualified: Y; Channel Type: P; IDM [max] (A): -0.64; Packing: Tape & Reel; Mounting Technology: Surface Mount; PackageDescription: 6-Pin Small Outline Transistor Package, Body 2 x 1.25 mm, Pitch 0.65 mm; ComponentLink2URL: http://www.nxp.com/documents/data_sheet/BSS84AKS.pdf; ComponentLink3URL: http://www.nxp.com/documents/outline_drawing/sot363_po.pdf; PartNumber: BSS84AKS,115; PackageReference: SOT363; PackageVersion: 06-03-16, 03/2006; ComponentLink3Description: Package Specification; ComponentLink2Description: Datasheet; ComponentLink1Description: Manufacturer URL; VDS [max] (V): -50; Code_JEITA: SC-88; ID [max] (A): -0.16; DatasheetVersion: Rev. 1; ComponentLink1URL: http://www.nxp.com/
R70 R82 R93 R100 = CMP-009-00002-14: Value: 100k
R71-R81 R83-R92 R94-R99 R101-R105 R107-R116 = CMP-009-00002-14: Resistor
  R72 R77 R84 R92 R94 R98 R101 R105 R113 R115: Value: 100k
  R80 R81: Value: 1k
  R107-R112 R114 R116: Value: 0
R117 = CMP-009-00002-14: Resistor; Value: 100k
U9 = CMP-015-00011-4: Quad Tunneling GMSL2/1 to CSI-2 Deserializer
U12 = CMP-06317-000025-1: QUAD HIGH-SIDE CURRENT SENSOR; Accuracy: 1%; Min Operating Temperature: -40°C; Mount: Surface Mount; Max Operating Temperature: 85°C; Packaging: Cut Tape; RoHS Compliant: No
Y4 = CMP-2000-05733-3: Crystal 25MHz ±20ppm (Tol) ±30ppm (Stability) 18pF FUND 60Ω 4-Pin SMD T/R; Series Resistance: 60R; Length: 3.2mm; Depth: 2.5mm; Packaging: Tape and Reel; Min Operating Temperature: -40°C; Operating Frequency: 25 MHz; Lead Free: Lead Free; Number of Pins: 4; Frequency Tolerance: 20ppm; Radiation Hardening: No; Max Operating Temperature: 85°C; Termination: SMD/SMT; Frequency Stability: 30ppm; Frequency: 25MHz; Series: ABM8G; Mount: Surface Mount; Package Quantity: 1000; Height: 0.039inch; Width: 0.098inch; Case/Package: CSMD; ESR (Equivalent Series Resistance): 60R; Load Capacitance: 18pF; Tolerance: 20ppm

## Sheet PWR_SW.SchDoc
size A4; SheetNumber: 11; SheetTotal: 21
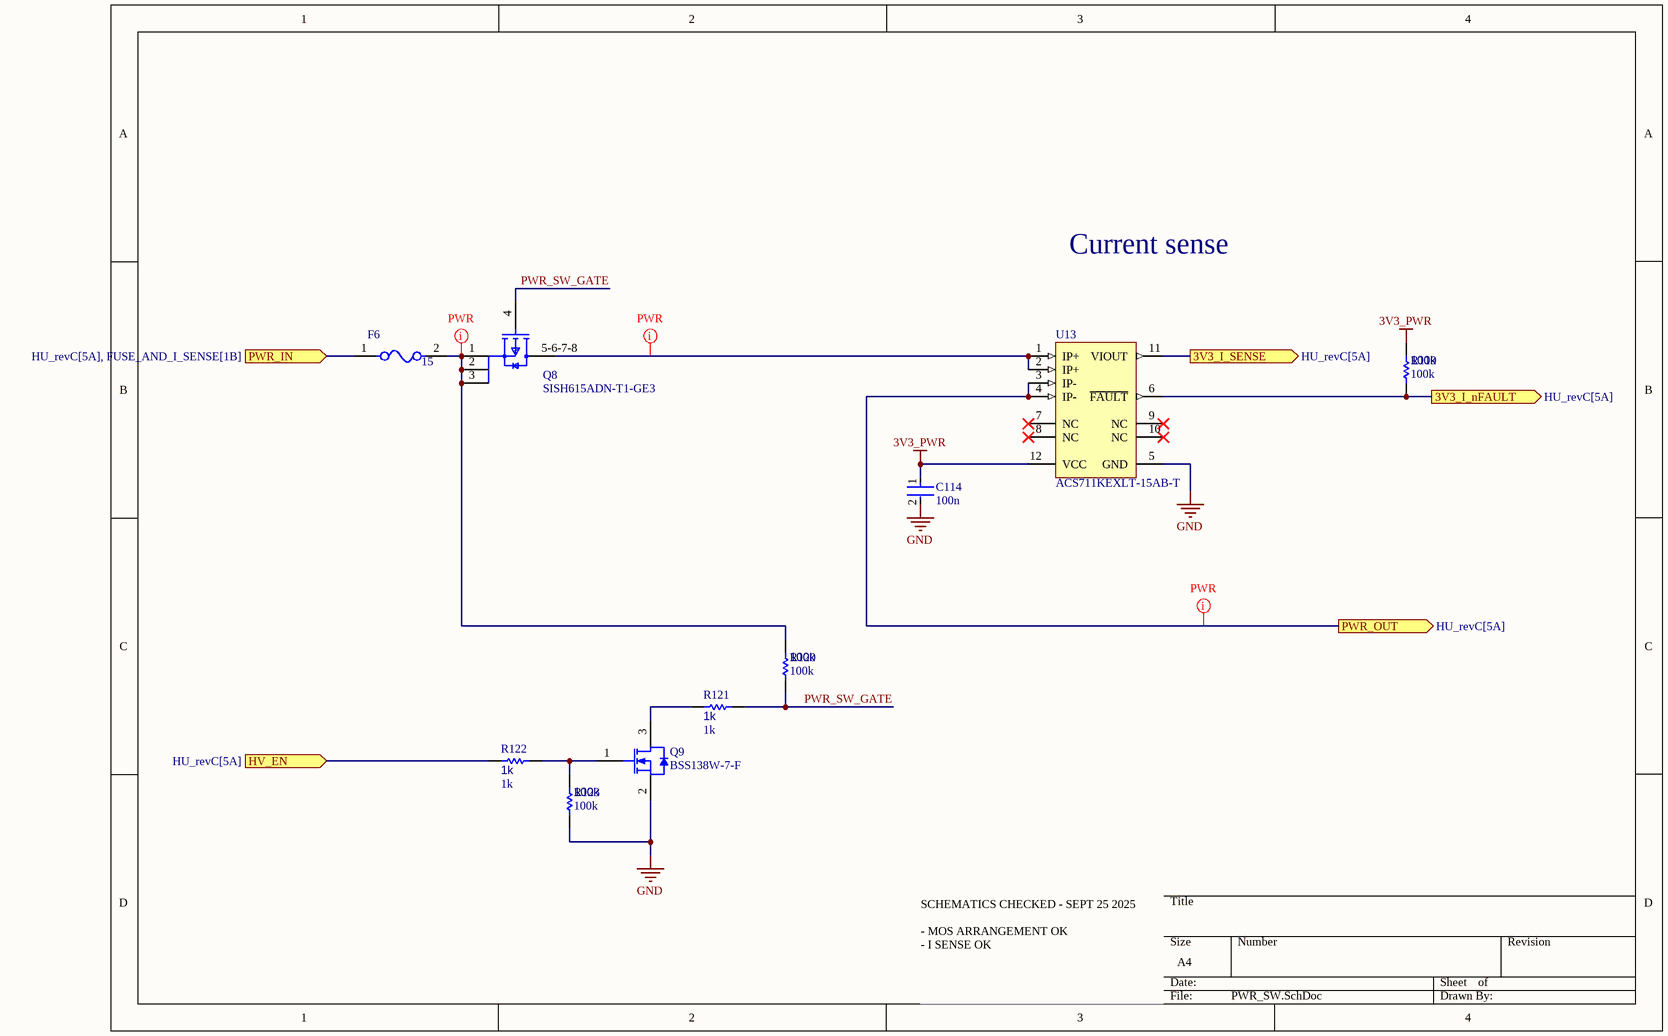
[diagram p19: PWR_SW.SchDoc]

### Parts
C114  100n  [FP-0402-L_1_0_0_05-W_0_5-IPC_A]
F6  15  [FP-0685T-MFG]
Q8  SISH615ADN-T1-GE3  [SISH615ADN-T1-GE3-Footprint-1]
Q9  BSS138W-7-F  [DIOD-SOT323-3_V]
R119  100k  [R0603B]
R120  100k  [R0603B]
R121  1k  [R0603B]
R122  1k  [R0603B]
R123  100k  [R0603B]
U13  ACS711KEXLT-15AB-T  [ALEG-EX-12_V]

### Ports
3V3_I_nFAULT (out, see HU_revC[5A]), 3V3_I_SENSE (out, see HU_revC[5A]), HV_EN (in, see HU_revC[5A]), PWR_IN (in, see HU_revC[5A], FUSE_AND_I_SENSE[1B]), PWR_OUT (out, see HU_revC[5A])

### Nets
3V3_PWR: C114.1 R119.2 U13.12(VCC)
AMP_VCC: U13.3(IP-) U13.4(IP-) ; port PWR_OUT
GND: C114.2 Q9.2(S) R123.1 U13.5(GND)
INT_VCC: F6.1 ; port PWR_IN
3V3_AMP_I_SENSE: U13.11(VIOUT) ; port 3V3_I_SENSE
3V3_AMP_PWR_EN: R122.1 ; port HV_EN
3V3_PWR_nFLT: R119.1 U13.6(~{FAULT}) ; port 3V3_I_nFAULT
PWR_SW_GATE: Q8.4(G) R120.1 R121.2
NetF6_2: F6.2 Q8.1(S) Q8.2(S) Q8.3(S) R120.2
NetQ8_5-6-7-8: Q8.5-6-7-8(D) U13.1(IP+) U13.2(IP+)
NetQ9_1: Q9.1(G) R122.2 R123.2
NetQ9_3: Q9.3(D) R121.1

Not connected (* = marked no-connect by the designer): U13 7(NC)* 8(NC)* 9(NC)* 10(NC)*

### Layout directives
net class PWR: AMP_VCC, NetF6_2, NetQ8_5-6-7-8

### Notes on the sheet
- Current sense
- SCHEMATICS CHECKED - SEPT 25 2025
  - MOS ARRANGEMENT OK
  - I SENSE OK

### Library data of the parts
C114 = CMP-001-00058-1: as C65 on sheet MAX96724_PINOUT; Min Operating Temperature: -55°C; Mounting Technology: Surface Mount; Pins: 2; Case/Package: 0402; RoHS Compliant: Yes; Max Operating Temperature: 85°C
F6 = CMP-16042-000006-1: FUSE BOARD MNT 5A 63VAC/VDC 1206; RoHS Compliant: Yes
Q8 = CMP-013-00018-2: Trans MOSFET P-CH 20V 22.1A 8-Pin PowerPAK 1212 EP T/R; Source: SISH615ADN-T1-GE3.SchLib; Design Item ID: CMP-013-00036-4; Component Type: Standard; Pins: 5
Q9 = CMP-2000-05968-1: N-Channel Enhancement Mode Mosfet, 50 V, 200 mA, -55 to 150 degC, 6-Pin SOT-323, RoHS, Tape and Reel; Typical Turn-Off Delay Time: 20ns; Number of Channels: 1Channel; Type: EnhancementModeFieldEffectTransistor; Brand: DiodesIncorporated; Vds - Drain-Source Breakdown Voltage: 75V; Vgs - Gate-Source Voltage: 20V; Rds On - Drain-Source Resistance: 1.4Ohms; Transistor Type: 1N-Channel; Configuration: Single; Unit Weight: 0.000212oz; Pd - Power Dissipation: 200mW; Id - Continuous Drain Current: 200mA; Forward Transconductance - Min: 0.1S; Manufacturer URL: http://www.diodes.com/; Series: BSS138; Package Description: 3-Pin Small Outline Transistor, Body 2 x 1.25 mm, Pitch 0.65 mm; Mounting Technology: SurfaceMount; Product Category: MOSFET; RoHS: True; Maximum Operating Temperature: +150C; Height: 1mm; Length: 2.2mm; Technology: Si; Width: 1.35mm; Datasheet URL: http://www.diodes.com/_files/datasheets/ds30206.pdf; Manufacturer: DiodesIncorporated; Package / Case: SOT-323-3; Typical Turn-On Delay Time: 20ns; Transistor Polarity: N-Channel; Factory Pack Quantity: 3000; Packaging: Reel; Product: MOSFETSmallSignal; Datasheet Version: Rev. 11-2, 09/2013; Package Reference: SOT323; Minimum Operating Temperature: -55C; Mounting Style: SMD/SMT; Channel Mode: Enhancement
R119-R123 = CMP-009-00002-14: Resistor
  R119 R120 R123: Value: 100k
  R121 R122: Value: 1k
U13 = CMP-1557-00001-1: Hall Effect Linear Current Sensor with Overcurrent Fault Output for <100 V Isolation Applications, 3 to 5.5 V, -15.5 to 15.5 A IP, -40 to 125 degC, 12-Pin QFN (EX), RoHS, Tape and Reel; VCC Max: 5.5 V; IP Max: 15.5 A; VCC Min: 3 V; IP Min: -15.5 A; -3dB Bandwidth: 0.1 MHz; PackageDescription: 12-Pin Quad Flat No-Lead, Body 3 x 3 mm, Height 0.8 mm; ComponentLink1URL: http://www.allegromicro.com/; Packing: Tape and Reel; ComponentLink2URL: http://www.allegromicro.com/~/media/Files/Datasheets/ACS711-Datasheet.ashx?la=en; DatasheetVersion: Rev. 3; PartNumber: ACS711KEXLT-15AB-T; ComponentLink2Description: Datasheet; ComponentLink3URL: http://www.allegromicro.com/~/media/Files/Datasheets/ACS711-Datasheet.ashx?la=en; RoHS: TRUE; ComponentLink1Description: Manufacturer URL; ComponentLink3Description: Package Specification; Temperature Max: 125 degC; Mounting Technology: Surface Mount; Temperature Min: -40 degC

## Sheet MAX_M10M_PINOUT.SchDoc
size B; SheetNumber: 12; SheetTotal: 21
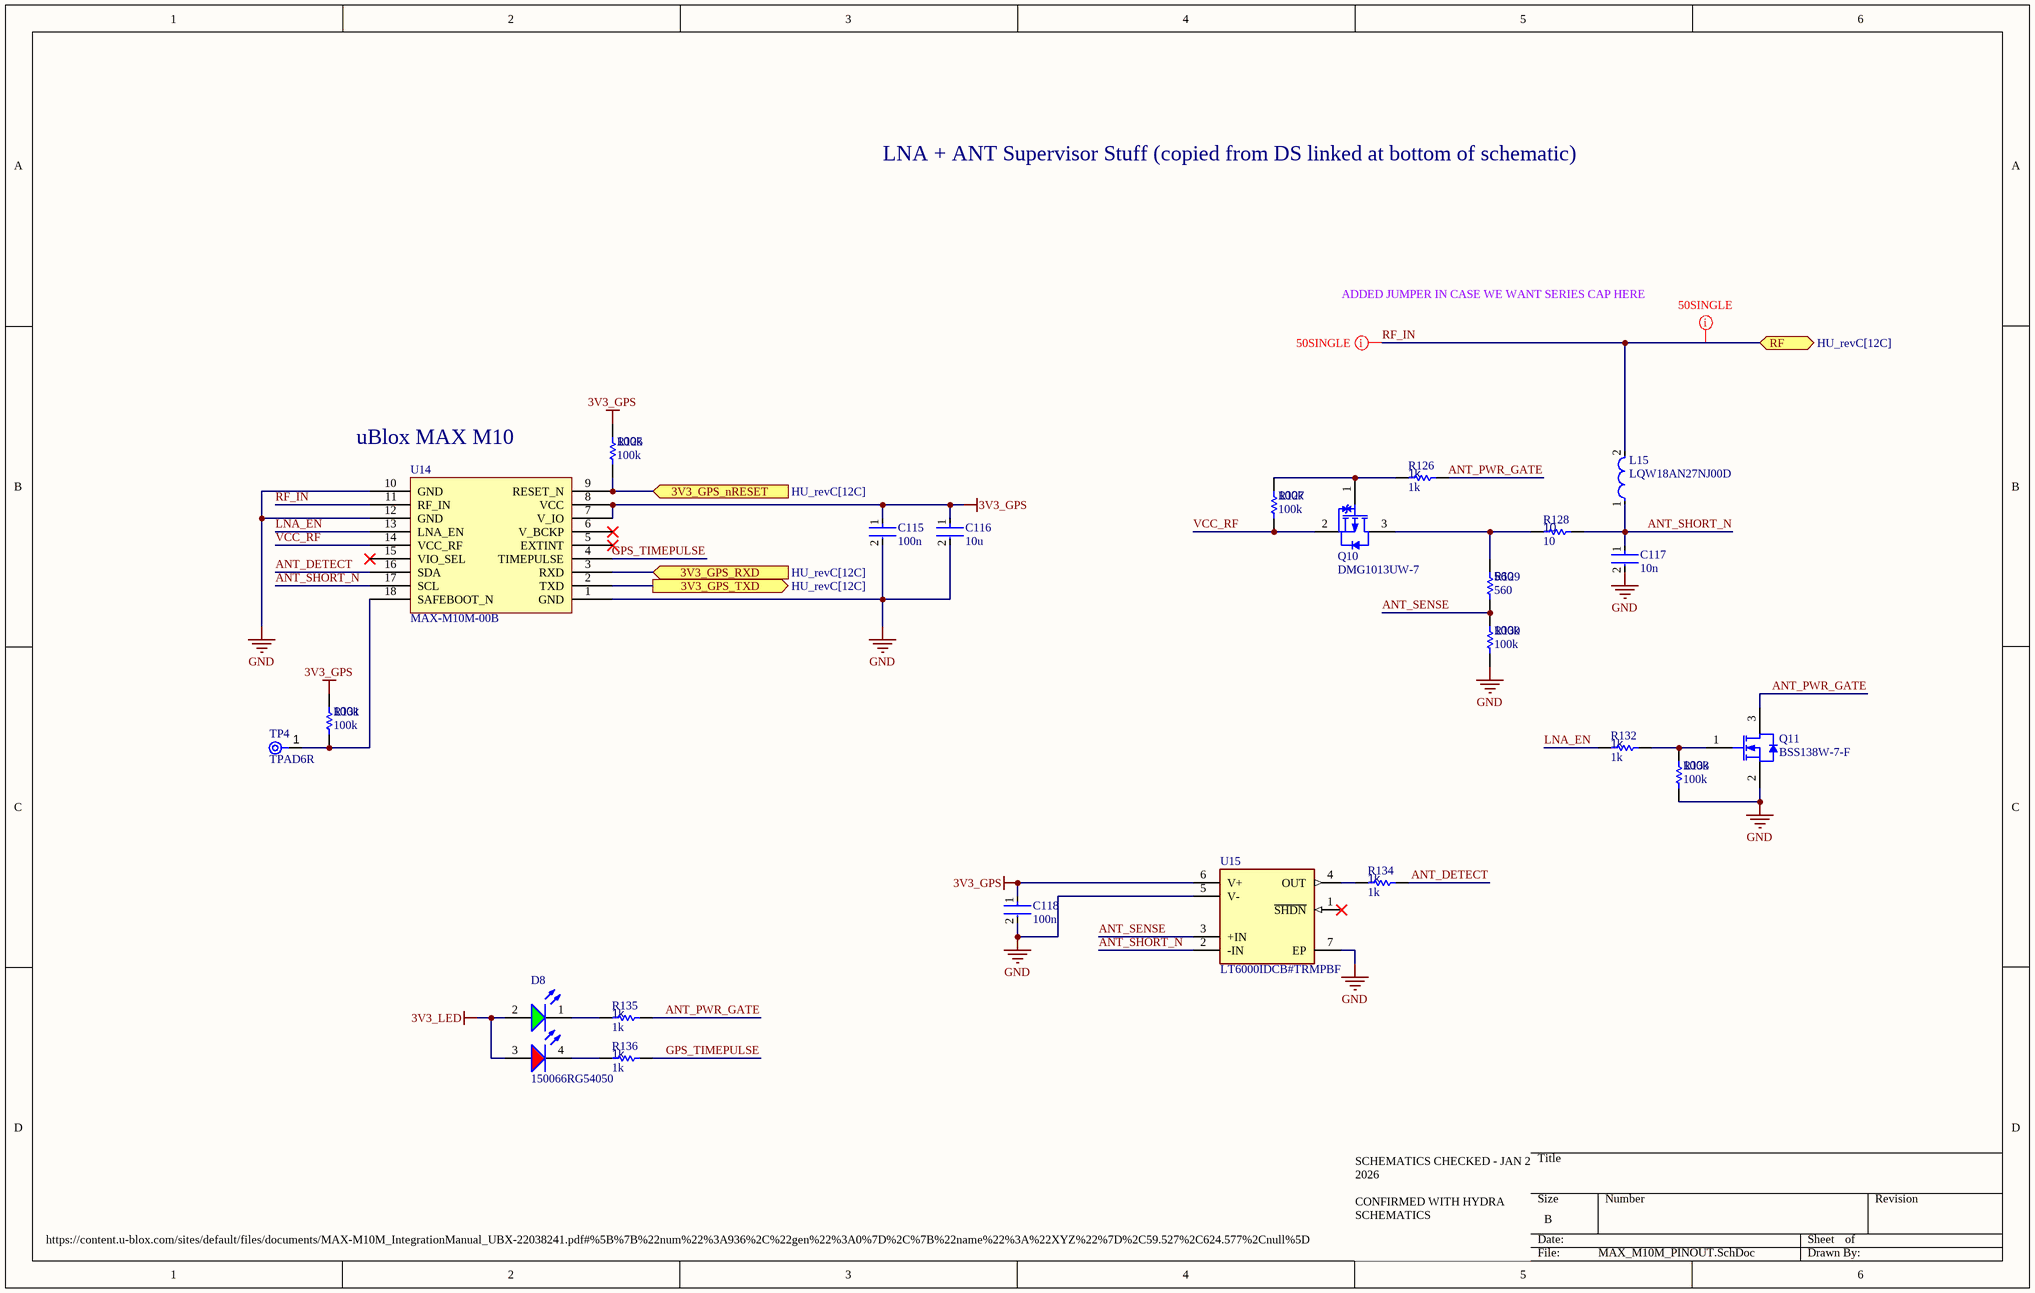
[diagram p20: MAX_M10M_PINOUT.SchDoc]

### Parts
C115  100n  [FP-0402-L_1_0_0_05-W_0_5-IPC_A]
C116  10u  [FP-0402-L_1_0_0_05-W_0_5-IPC_A]
C117  10n  [FP-0402-L_1_0_0_05-W_0_5-IPC_A]
C118  100n  [FP-0402-L_1_0_0_05-W_0_5-IPC_A]
D8  150066RG54050  [WL-SBCD_0606]
L15  LQW18AN27NJ00D  [FP-LQW18AN_00-MFG]
Q10  DMG1013UW-7  [DIOD-SOT323-3_V]
Q11  BSS138W-7-F  [DIOD-SOT323-3_V]
R125  100k  [R0603B]
R126  1k  [R0603B]
R127  100k  [R0603B]
R128  10  [R0603B]
R129  560  [R0603B]
R130  100k  [R0603B]
R131  100k  [R0603B]
R132  1k  [R0603B]
R133  100k  [R0603B]
R134  1k  [R0603B]
R135  1k  [R0603B]
R136  1k  [R0603B]
TP4  TPAD6R  [New footprint 1]
U14  MAX-M10M-00B  [MAX-M10M-00B-Footprint-1]
U15  LT6000IDCB#TRMPBF  [FP-DCB-6-05-08-1715-MFG]

### Ports
3V3_GPS_nRESET (in, see HU_revC[12C]), 3V3_GPS_RXD (in, see HU_revC[12C]), 3V3_GPS_TXD (out, see HU_revC[12C]), RF (bidir, see HU_revC[12C])

### Nets
3V3_GPS: C115.1 C116.1 C118.1 R125.1 R131.1 U14.7(V_IO) U14.8(VCC) U15.6(V+)
3V3_LED: D8.2(A) D8.3(A)
GND: C115.2 C116.2 C117.2 C118.2 Q11.2(S) R130.2 R133.2 U14.1(GND) U14.10(GND) U14.12(GND) U15.5(V-) U15.7(EP)
ANT_DETECT: R134.2 U14.16(SDA)
ANT_PWR_GATE: Q11.3(D) R126.2 R135.1
ANT_SENSE: R129.2 R130.1 U15.3(+IN)
ANT_SHORT_N: C117.1 L15.1 R128.2 U14.17(SCL) U15.2(-IN)
GPS_TIMEPULSE: R136.1 U14.4(TIMEPULSE)
LNA_EN: R132.1 U14.13(LNA_EN)
RF_IN: L15.2 U14.11(RF_IN) ; port RF  [project net MAX_M10M_RF_IN]
VCC_RF: Q10.2(S) R127.2 U14.14(VCC_RF)
NetD8_1: D8.1(K) R135.2
NetD8_4: D8.4(K) R136.2
NetQ10_1: Q10.1(G) R126.1 R127.1
NetQ10_3: Q10.3(D) R128.1 R129.1
NetQ11_1: Q11.1(G) R132.2 R133.1
NetR125_2: R125.2 U14.9(RESET_N) ; port 3V3_GPS_nRESET
NetR131_2: R131.2 TP4.1(TP) U14.18(SAFEBOOT_N)
NetR134_1: R134.1 U15.4(OUT)
NetR163_2: U14.2(TXD) ; port 3V3_GPS_TXD
NetR164_2: U14.3(RXD) ; port 3V3_GPS_RXD

Not connected (* = marked no-connect by the designer): U14 5(EXTINT)* 6(V_BCKP)* 15(VIO_SEL)*; U15 1(~{SHDN})*

### Layout directives
net class 50SINGLE: MAX_M10M_RF_IN

### Notes on the sheet
- LNA + ANT Supervisor Stuff (copied from DS linked at bottom of schematic)
- ADDED JUMPER IN CASE WE WANT SERIES CAP HERE
- (near U14) uBlox MAX M10
- https://content.u-blox.com/sites/default/files/documents/MAX-M10M_IntegrationManual_UBX-22038241.pdf#%5B%7B%22num%22%3A936%2C%22gen%22%3A0%7D%2C%7B%22name%22%3A%22XYZ%22%7D%2C59.527%2C624.577%2Cnull%5D
- SCHEMATICS CHECKED - JAN 2 2026
  CONFIRMED WITH HYDRA SCHEMATICS

### Library data of the parts
C115-C118 = CMP-001-00058-1: as C65 on sheet MAX96724_PINOUT; Min Operating Temperature: -55°C; Mounting Technology: Surface Mount; Pins: 2; Case/Package: 0402; RoHS Compliant: Yes; Max Operating Temperature: 85°C
  C115 C118: Value: 100n
  C116: Value: 10u
  C117: Value: 10n
D8 = CMP-004-00040-2: as D7 on sheet MAX96724_PINOUT; Source: rgled.SchLib; Component Type: Standard; Design Item ID: CMP-004-00034-2; Pins: 4
L15 = CMP-06042-013840-1: Wire Wound RF Inductor 27nH ±5% 440mA 0.21Ω 0603 (1608); Shielding: Unshielded; Test Frequency: 100MHz; Q Factor: 40; Self Resonant Frequency: 3.7GHz; DC Resistance (DCR): 210mR; Core Material: Non-Magnetic; Depth: 1mm; Min Operating Temperature: -55°C; Package Quantity: 4000; Inductance: 27nH; Case Code (Metric): 1608; Height - Seated (Max): 0.039inch; Resistor Type: Wirewound; Max DC Current: 440mA; Tolerance: 5%; Length: 1.6mm; Mount: Surface Mount; DC Current: 440mA; Packaging: Tape and Reel; Lead Free: Lead Free; Case Code (Imperial): 0603; Current Rating: 440mA; Width: 0.8mm; Max Operating Temperature: 125°C; Termination: SMD/SMT; Weight: 0.000106oz; Radiation Hardening: No; Height: 0.8mm; Case/Package: 0603; Military Standard: Not
Q10 = CMP-2000-06170-1: P-Channel Enhancement Mode MOSFET, 310 mW, 20 V, -55 to 150 degC, 3-Pin SOT-323, RoHS, Tape and Reel; Manufacturer: Diodes Inc; Qg Gate Charge: 0.622nC; Drain-Source On Resistance-Max: 750mO; Rated Power Dissipation: 310mW; Drain-to-Source Voltage [Vdss]: 20V; Package Reference: SOT323; Datasheet Version: Rev. 3-2, 09/2013; Package Description: 3-Pin Small Outline Transistor, Body 2 x 1.25 mm, Pitch 0.65 mm; Mounting Technology: SurfaceMount; Manufacturer URL: http://www.diodes.com/; Datasheet URL: http://www.diodes.com/_files/datasheets/ds31861.pdf; Channel Type: P-Channel
Q11 = CMP-2000-05968-1: as Q9 on sheet PWR_SW; Manufacturer URL: http://www.diodes.com/; Series: BSS138; Package Description: 3-Pin Small Outline Transistor, Body 2 x 1.25 mm, Pitch 0.65 mm; Mounting Technology: SurfaceMount; Product Category: MOSFET; RoHS: True; Maximum Operating Temperature: +150C; Height: 1mm; Length: 2.2mm; Technology: Si; Width: 1.35mm; Datasheet URL: http://www.diodes.com/_files/datasheets/ds30206.pdf; Manufacturer: DiodesIncorporated; Package / Case: SOT-323-3; Typical Turn-On Delay Time: 20ns; Transistor Polarity: N-Channel; Factory Pack Quantity: 3000; Packaging: Reel; Product: MOSFETSmallSignal; Datasheet Version: Rev. 11-2, 09/2013; Package Reference: SOT323; Minimum Operating Temperature: -55C; Mounting Style: SMD/SMT; Channel Mode: Enhancement
R125-R136 = CMP-009-00002-14: Resistor
  R125 R127 R130 R131 R133: Value: 100k
  R126 R132 R134-R136: Value: 1k
  R128: Value: 10
  R129: Value: 560
TP4 = CMP-00025-2: Test Point .6mm
U14 = CMP-010-00031-2: Gnss Lcc Rx Mod, Rom, Crystal
U15 = CMP-09116-000039-1: IC OPAMP GP 1 CIRCUIT 6DFN; Number of Elements: 1; Power Supply Rejection Ratio (PSRR): 86dB; Output Current per Channel: 10mA; Gain Bandwidth Product: 60kHz; Operating Supply Current: 20uA; Input Bias Current: 12nA; Voltage Gain: 120dB; Max Supply Voltage: 18V; Input Offset Voltage (Vos): 1.2mV; Min Supply Voltage: 1.8V; Slew Rate: 0.018V/µs; Common Mode Rejection Ratio: 68dB; Packaging: Tape and Reel; Mount: Surface Mount; Case/Package: DFN; Max Operating Temperature: 85°C; Number of Pins: 6; Number of Amplifiers: 1; REACH SVHC: No SVHC; Unity Gain Bandwidth Product: 60kHz; Bandwidth: 60kHz; Lead Free: Lead Free; Number of Circuits: 1; Min Operating Temperature: -40°C; Package Quantity: 1

## Sheet TCAN1146_PINOUT.SchDoc
size B; SheetNumber: 15; SheetTotal: 21
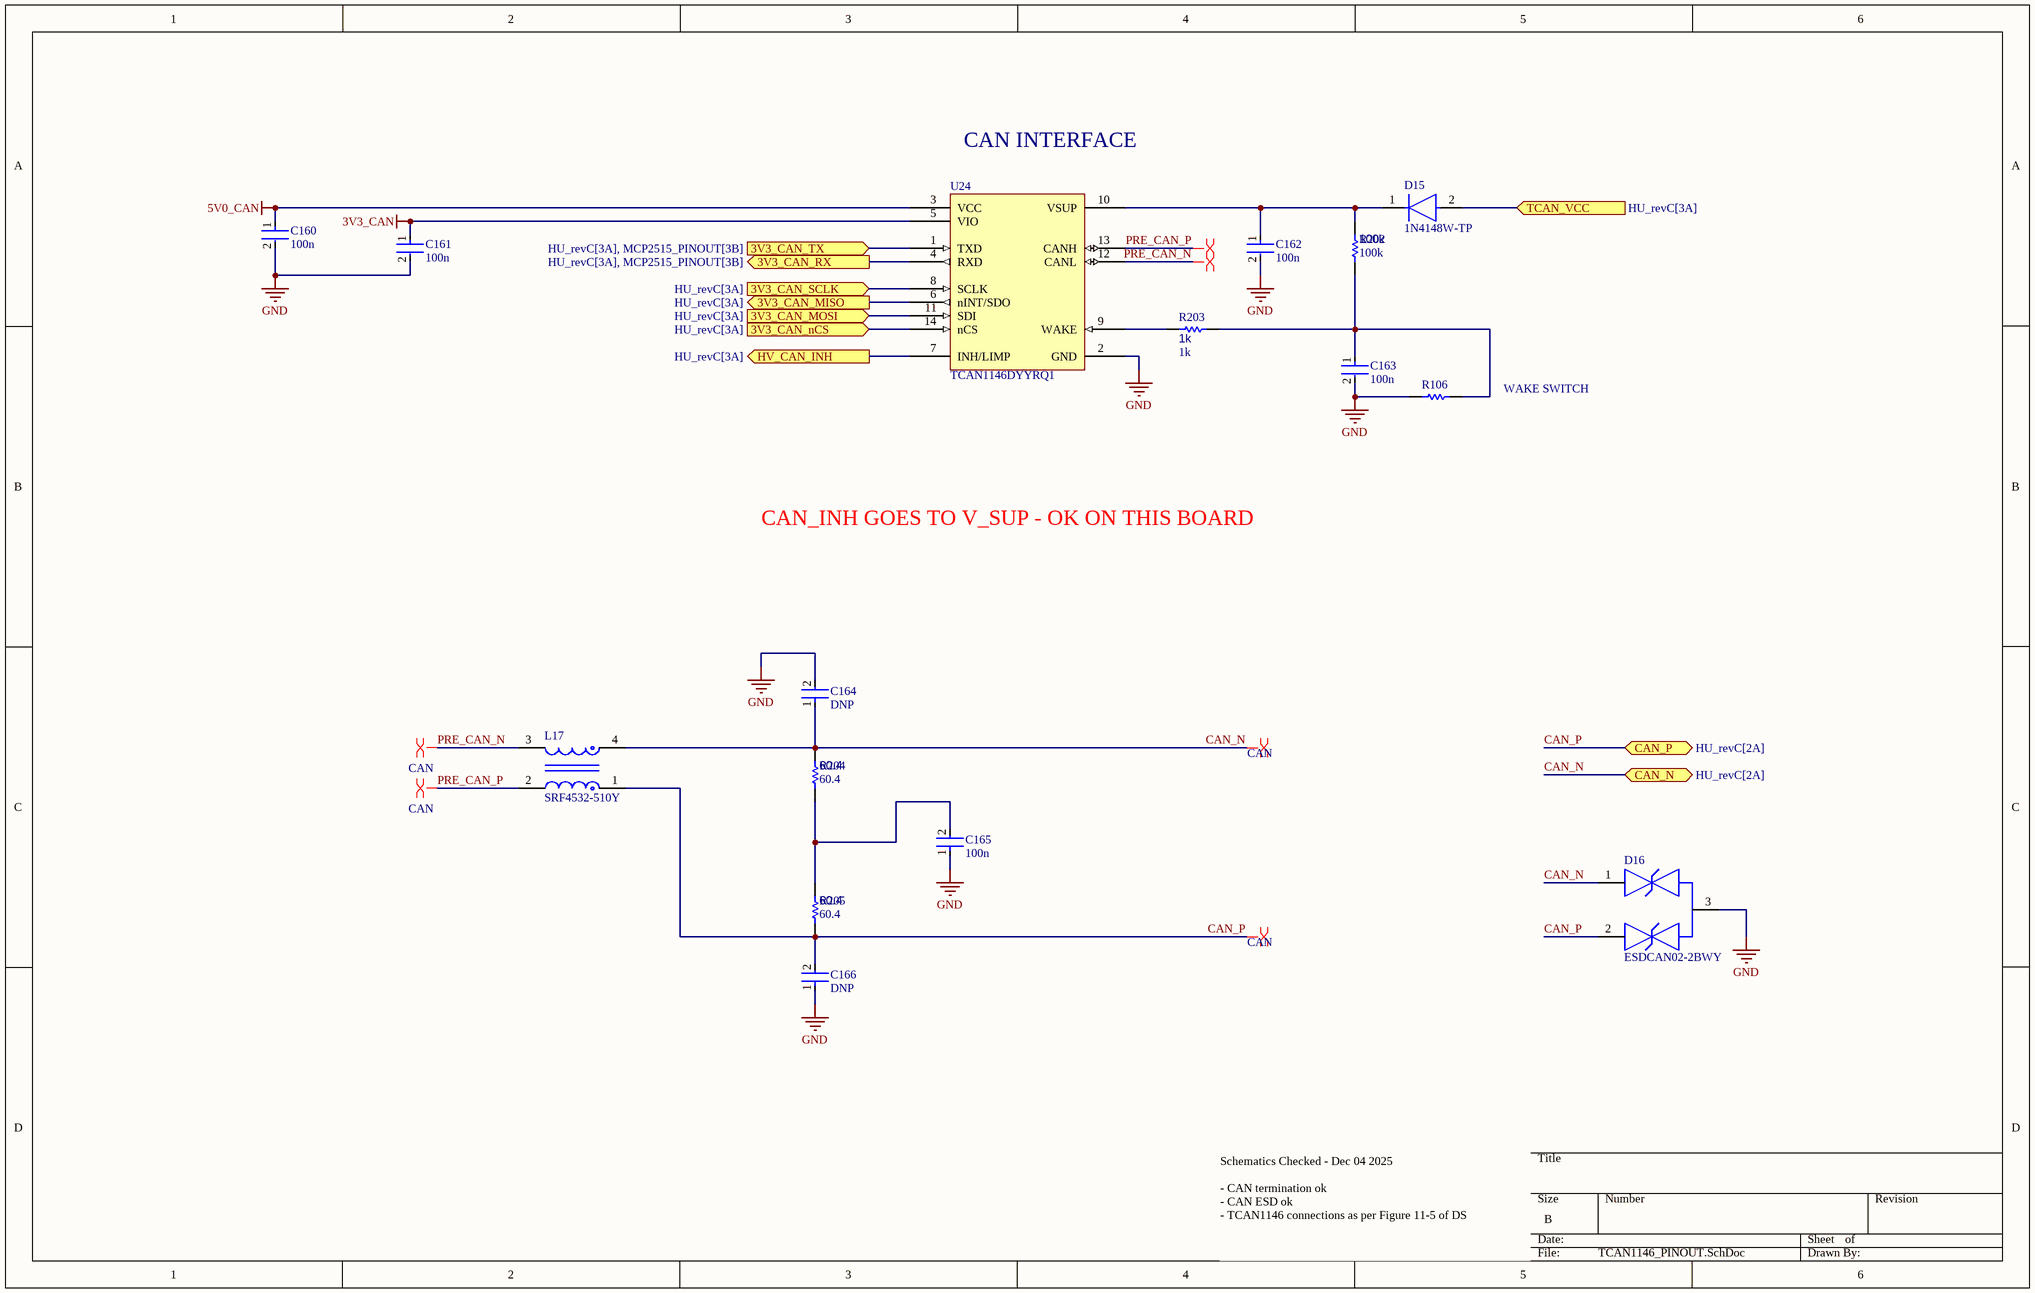
[diagram p21: TCAN1146_PINOUT.SchDoc]

### Parts
C160  100n  [FP-0402-L_1_0_0_05-W_0_5-IPC_A]
C161  100n  [FP-0402-L_1_0_0_05-W_0_5-IPC_A]
C162  100n  [FP-0402-L_1_0_0_05-W_0_5-IPC_A]
C163  100n  [FP-0402-L_1_0_0_05-W_0_5-IPC_A]
C164  DNP  [FP-0402-L_1_0_0_05-W_0_5-IPC_A]
C165  100n  [FP-0402-L_1_0_0_05-W_0_5-IPC_A]
C166  DNP  [FP-0402-L_1_0_0_05-W_0_5-IPC_A]
D15  1N4148W-TP  [FP-SOD-123-IPC_A]
D16  ESDCAN02-2BWY  [FP-SOT323-3L-MFG]
L17  SRF4532-510Y  [FP-SRF4532-MFG]
R106  0402 JUMPER  [RESC1005X40X25ML05T05]  (value not drawn)
R202  100k  [R0603B]
R203  1k  [R0603B]
R204  60.4  [R0603B]
R205  60.4  [R0603B]
U24  TCAN1146DYYRQ1  [TCAN1146DYYRQ1-Footprint-1]

### Ports
3V3_CAN_MISO (out, see HU_revC[3A]), 3V3_CAN_MOSI (in, see HU_revC[3A]), 3V3_CAN_nCS (in, see HU_revC[3A]), 3V3_CAN_RX (out, see HU_revC[3A], MCP2515_PINOUT[3B]), 3V3_CAN_SCLK (in, see HU_revC[3A]), 3V3_CAN_TX (in, see HU_revC[3A], MCP2515_PINOUT[3B]), CAN_N (bidir, see HU_revC[2A]), CAN_P (bidir, see HU_revC[2A]), HV_CAN_INH (out, see HU_revC[3A]), TCAN_VCC (in, see HU_revC[3A])

### Nets
3V3_CAN: C161.1 U24.5(VIO)
5V0_CAN: C160.1 U24.3(VCC)
GND: C160.2 C161.2 C162.2 C163.2 C164.2 C165.1 C166.1 D16.3 R106.1 U24.2(GND)
PRE_VCC: D15.2(A) ; port TCAN_VCC
3V3_CAN_RX: U24.4(RXD) ; port 3V3_CAN_RX
3V3_CAN_TX: U24.1(TXD) ; port 3V3_CAN_TX
3V3_TCAN1146_MISO: U24.6(nINT/SDO) ; port 3V3_CAN_MISO
3V3_TCAN1146_MOSI: U24.11(SDI) ; port 3V3_CAN_MOSI
3V3_TCAN1146_nCS: U24.14(nCS) ; port 3V3_CAN_nCS
3V3_TCAN1146_SCLK: U24.8(SCLK) ; port 3V3_CAN_SCLK
CAN_N: C164.1 D16.1 L17.4 R204.2 ; port CAN_N
CAN_P: C166.2 D16.2 L17.1 R205.1 ; port CAN_P
HV_PWR_EN: U24.7(INH/LIMP) ; port HV_CAN_INH
PRE_CAN_N: L17.3 U24.12(CANL)
PRE_CAN_P: L17.2 U24.13(CANH)
NetC162_1: C162.1 D15.1(C) R202.2 U24.10(VSUP)
NetC163_1: C163.1 R106.2 R202.1 R203.2
NetC165_2: C165.2 R204.1 R205.2
NetR203_1: R203.1 U24.9(WAKE)

### Layout directives
differential pair: PRE_CAN_N, PRE_CAN_P
differential pair; differential pair class CAN: CAN_N, CAN_P, PRE_CAN_N, PRE_CAN_P

### Notes on the sheet
- CAN INTERFACE
- WAKE SWITCH
- CAN_INH GOES TO V_SUP - OK ON THIS BOARD
- Schematics Checked - Dec 04 2025
  - CAN termination ok
  - CAN ESD ok
  - TCAN1146 connections as per Figure 11-5 of DS

### Library data of the parts
C160-C166 = CMP-001-00058-1: as C65 on sheet MAX96724_PINOUT; Min Operating Temperature: -55°C; Mounting Technology: Surface Mount; Pins: 2; Case/Package: 0402; RoHS Compliant: Yes; Max Operating Temperature: 85°C
D15 = CMP-2000-04993-2: DIODE GEN PURP 100V 150MA SOD123; Max Reverse Leakage Current: 5uA; Max Surge Current: 2A; Reverse Recovery Time: 4ns; Polarity: Standard; Capacitance: 4pF; Max Forward Surge Current (Ifsm): 1A; Element Configuration: Single; Power Dissipation: 400mW; Forward Voltage: 1V; Radiation Hardening: No; Lead Free: Lead Free; Max Reverse Voltage (DC): 100V; Current Rating: 150mA; Forward Current: 150mA; Packaging: Tape and Reel; Number of Pins: 2; Package Quantity: 3000; Max Operating Temperature: 150°C; Min Operating Temperature: -65°C; Average Rectified Current: 150mA; Recovery Time: 4ns; Output Current: 150mA; Peak Non-Repetitive Surge Current: 2A; Width: 1.8mm; Voltage Rating (DC): 100V; Height: 1.2mm; Max Repetitive Reverse Voltage (Vrrm): 100V; Mount: Surface Mount; Length: 2.85mm
D16 = CMP-12225-000055-1: TVS DIODE 26.5V 44V SOT323-3; Manufacturer: STMicroelectronics; Value: 3pF; Direction: Bidirectional; Breakdown Voltage: 28.5V; Automotive Grade: Grade 0; Standoff Height: 0mm; Peak Pulse Power: 170W; Peak Pulse Current: 3A; Number Of Channels: 2; Max Junction Temp: +175°C; Mouser Description: TVS Diodes / ESD Suppressors Automotive dual-line Transil, Transient voltage suppressor (TVS) for CAN bus; Height: 1.1mm; Category: Diode; Reverse Standoff Voltage: 26.5V; Device Class L1: Circuit Protection; Temperature: -55°C to +175°C; RoHS: TRUE; ComponentLink2URL: https://www.st.com/resource/en/datasheet/esdcan02-2bwy.pdf; Device Class L3: unset; Device Class L2: TVS Diodes; Temperature Range High: +175°C; Octopart: https://octopart.com/esdcan02-2bwy-stmicroelectronics-58631133; Ipc Land Pattern Name: SOT65P210X95-3; Temperature Range Low: -55°C; Capacitance: 3pF; Digikey Description: TVS DIODE 26.5V 44V SOT323-3; Automotive: Yes; ComponentLink2Description: Datasheet; Clamping Voltage: 44V; Manufacturer Part Number: ESDCAN02-2BWY; Lead Free: Yes; Package: SOT323-3L
L17 = CMP-07251-000006-1: CMC 51UH 200MA 2LN 2KOHM SMD; Element Configuration: Dual; Number of Lines: 2; Core Material: Ferrite; Impedance: 2kR; Test Frequency: 100kHz; Voltage Rating (DC): 50V; Insulation Resistance: 10MR; Material: Steel; Tolerance: 50%; DC Resistance (DCR): 3.5R; RoHS Compliant: Yes; Mount: Surface Mount; REACH SVHC: No SVHC; Termination: SMD/SMT; DC Current: 200mA; Current: 200mA; Lead Free: Lead Free; Contact Plating: Tin; Length: 4.5mm; Max DC Current: 200mA; Width: 0.126inch; Case/Package: 4532; Packaging: Tape and Reel; Package Quantity: 1; Min Operating Temperature: -40°C; Depth: 3.4mm; Series: SRF4532; Max Operating Temperature: 125°C; Current Rating: 200mA; Self Resonant Frequency: 100kHz; Height: 0.118inch; Inductance: 51uH; Resistance: 2kR
R106 = CMP-009-00118-2: READ THE NAME; Pins: 2; Component Type: Standard; Design Item ID: CMP-009-00206-2; Source: 0402jump.SchLib
R202-R205 = CMP-009-00002-14: Resistor
  R202: Value: 100k
  R203: Value: 1k
  R204 R205: Value: 60.4
U24 = CMP-318-000000-2: Automotive CAN FD transceiver with watchdog, bus diagnostics and partial networking via sele 14-SOT-23-THIN -40 to 150; Component Type: Standard; Design Item ID: CMP-015-00012-2; Pin Count: 14; Source: TCAN1146DYYRQ1.SchLib

## Sheet LM74910H_PINOUT.SchDoc
size B; SheetNumber: 14; SheetTotal: 21
Used 2 times, as channels OR_0, OR_1. Parts and nets are listed once, with the designators drawn on the sheet.
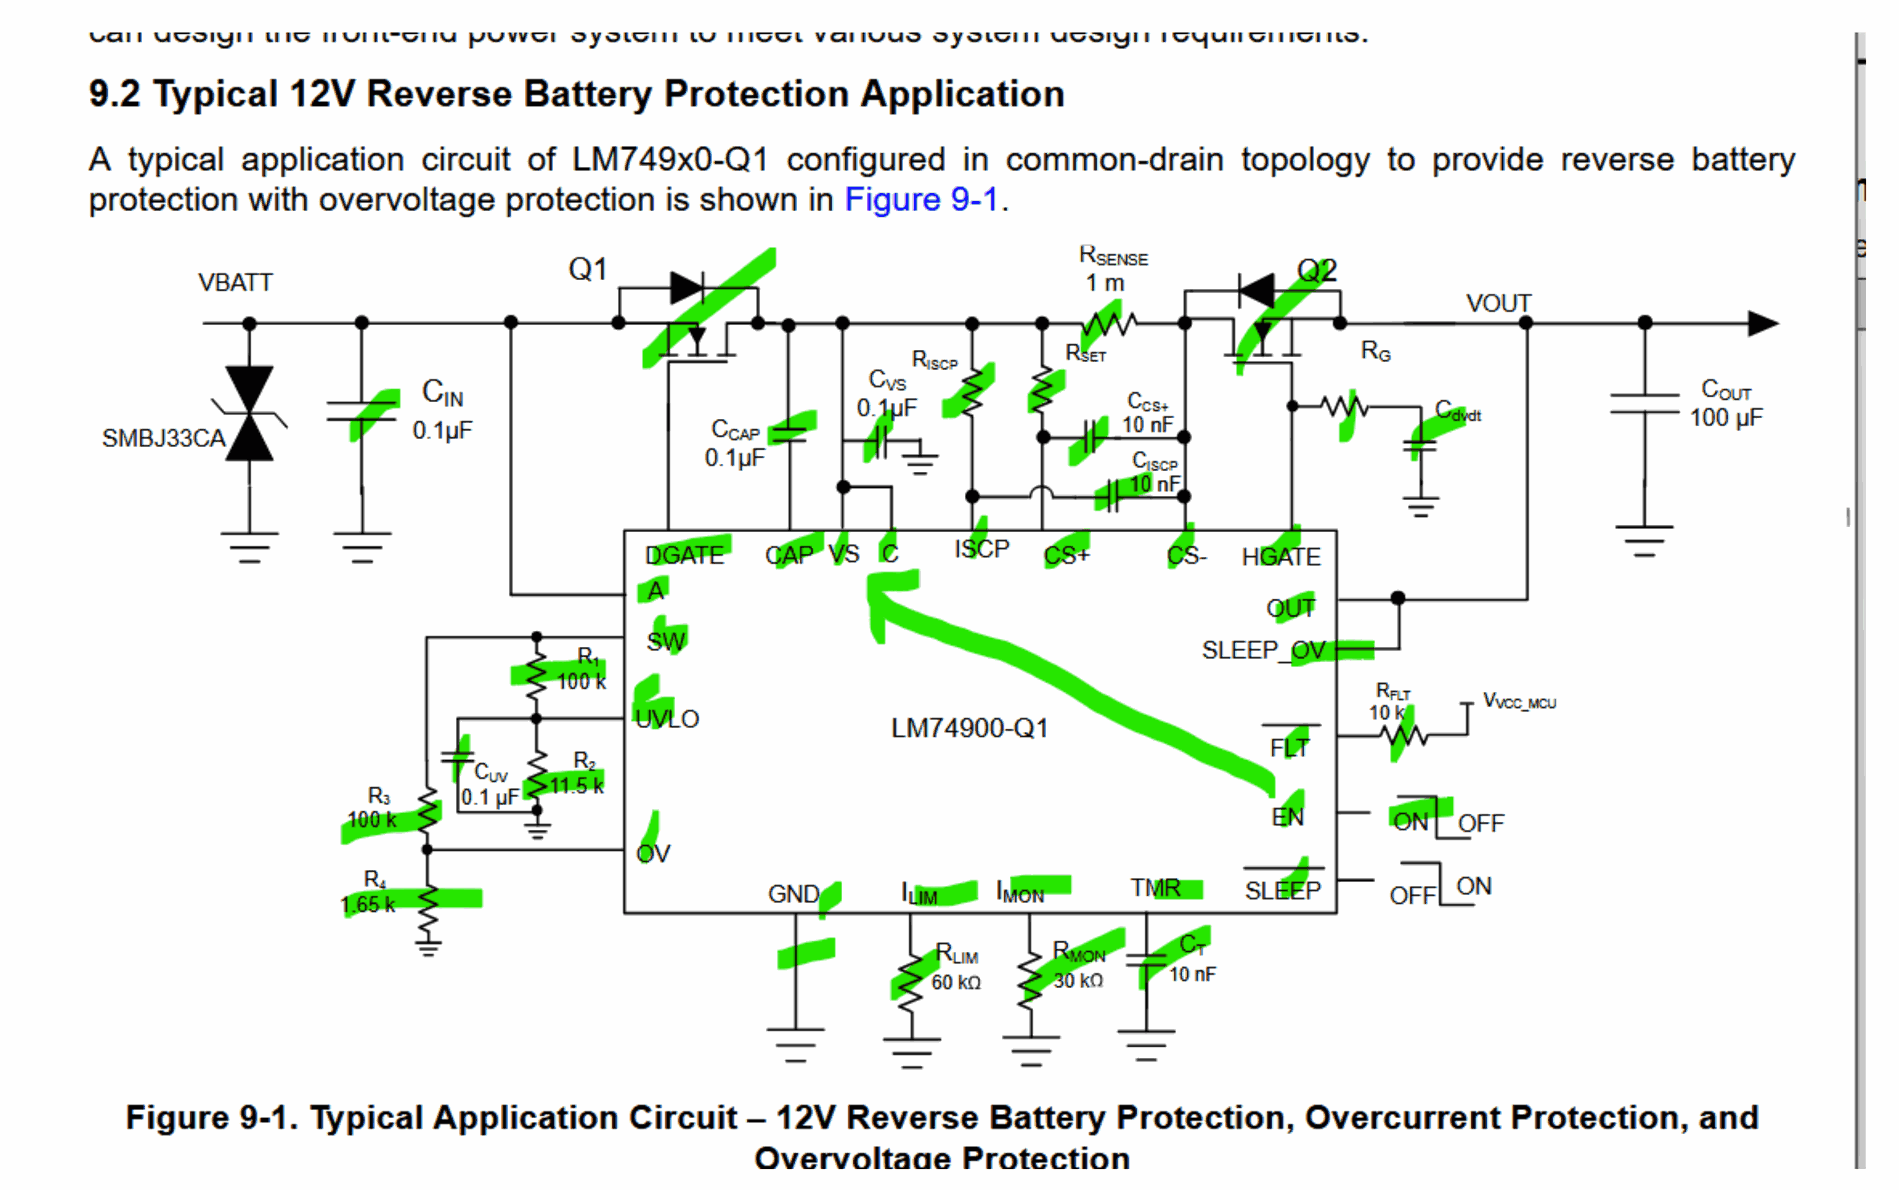
[diagram p22: LM74910H_PINOUT.SchDoc, top]
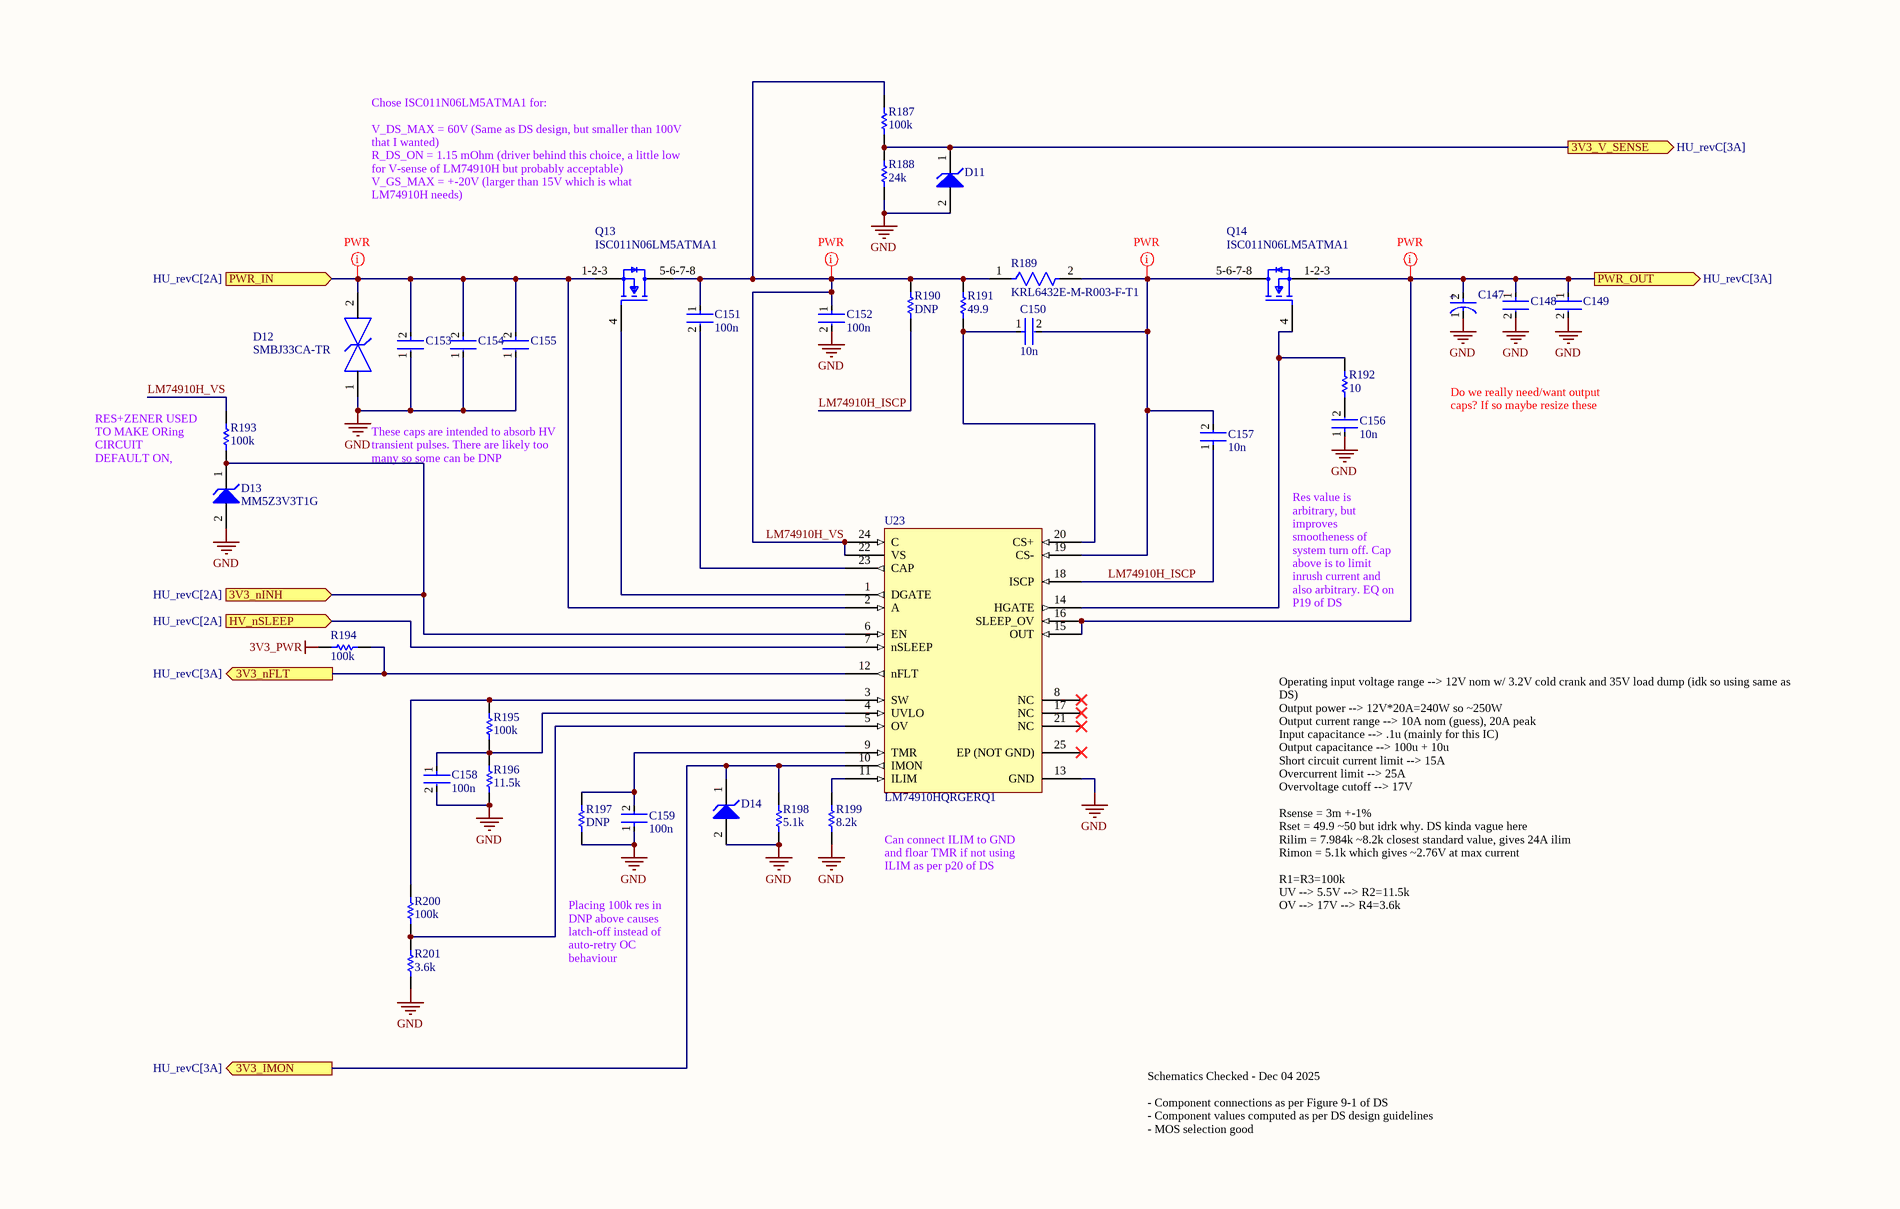
[diagram p23: LM74910H_PINOUT.SchDoc, bottom]

### Parts
C147  EEE-FK1H100UR  [FP-FKC-MFG]  (value not drawn)
C148  12103D106KAT2A  [FP-1210-L_3_3_0_4-W_2_5_0-MFG]  (value not drawn)
C149  12103D106KAT2A  [FP-1210-L_3_3_0_4-W_2_5_0-MFG]  (value not drawn)
C150  10n  [FP-0402-L_1_0_0_05-W_0_5-IPC_A]
C151  100n  [FP-0402-L_1_0_0_05-W_0_5-IPC_A]
C152  100n  [FP-0402-L_1_0_0_05-W_0_5-IPC_A]
C153  AC1210KKX7R0BB104  [FP-AC1210-0_85-MFG]  (value not drawn)
C154  AC1210KKX7R0BB104  [FP-AC1210-0_85-MFG]  (value not drawn)
C155  AC1210KKX7R0BB104  [FP-AC1210-0_85-MFG]  (value not drawn)
C156  10n  [FP-0402-L_1_0_0_05-W_0_5-IPC_A]
C157  10n  [FP-0402-L_1_0_0_05-W_0_5-IPC_A]
C158  100n  [FP-0402-L_1_0_0_05-W_0_5-IPC_A]
C159  100n  [FP-0402-L_1_0_0_05-W_0_5-IPC_A]
D11  DNP/MM5Z3V3T1G  [ONSC-SOD-523-2-502-01_V]  (value not drawn)
D12  SMBJ33CA-TR  [FP-SMB-CA-MFG]
D13  MM5Z3V3T1G  [ONSC-SOD-523-2-502-01_V]
D14  DNP/MM5Z3V3T1G  [ONSC-SOD-523-2-502-01_V]  (value not drawn)
Q13  ISC011N06LM5ATMA1  [FP-PG-TDSON-8-MFG]
Q14  ISC011N06LM5ATMA1  [FP-PG-TDSON-8-MFG]
R187  100k  [R0603B]
R188  24k  [R0603B]
R189  KRL6432E-M-R003-F-T1  [FP-KRL6432E-MFG]
R190  DNP  [R0603B]
R191  49.9  [R0603B]
R192  10  [R0603B]
R193  100k  [R0603B]
R194  100k  [R0603B]
R195  100k  [R0603B]
R196  11.5k  [R0603B]
R197  DNP  [R0603B]
R198  5.1k  [R0603B]
R199  8.2k  [R0603B]
R200  100k  [R0603B]
R201  3.6k  [R0603B]
U23  LM74910HQRGERQ1  [QFN50P400X400X100_HS-25N]

### Ports
3V3_IMON (out, see HU_revC[3A]), 3V3_nFLT (out, see HU_revC[3A]), 3V3_nINH (in, see HU_revC[2A]), 3V3_V_SENSE (out, see HU_revC[3A]), HV_nSLEEP (in, see HU_revC[2A]), PWR_IN (in, see HU_revC[2A]), PWR_OUT (out, see HU_revC[3A])

### Nets
3V3_PWR: R194.2
GND: C147.1(C) C148.2 C149.2 C152.2 C153.1 C154.1 C155.1 C156.1 C158.2 C159.1 D11.2(A) D12.1 D13.2(A) D14.2(A) R188.1 R196.1 R197.1 R198.1 R199.1 R201.1 U23.13(GND)
3V3_IMON: D14.1(K) R198.2 U23.10(IMON) ; port 3V3_IMON
3V3_nFLT: R194.1 U23.12(nFLT) ; port 3V3_nFLT
3V3_nINH: D13.1(K) R193.1 U23.6(EN) ; port 3V3_nINH
3V3_V_SENSE: D11.1(K) R187.1 R188.2 ; port 3V3_V_SENSE
HV_nSLEEP: U23.7(nSLEEP) ; port HV_nSLEEP
LM74910H_ISCP: C157.1 R190.1 U23.18(ISCP)
LM74910H_VS: C151.1 C152.1 Q13.5-6-7-8(D) R187.2 R189.1 R190.2 R191.2 R193.2 U23.22(VS) U23.24(C)
PWR_IN: C153.2 C154.2 C155.2 D12.2 Q13.1-2-3(S) U23.2(A) ; port PWR_IN
PWR_OUT: C147.2(A) C148.1 C149.1 Q14.1-2-3(S) U23.15(OUT) U23.16(SLEEP_OV) ; port PWR_OUT
NetC150_1: C150.1 R191.1 U23.20(CS+)
NetC150_2: C150.2 C157.2 Q14.5-6-7-8(D) R189.2 U23.19(CS-)
NetC151_2: C151.2 U23.23(CAP)
NetC156_2: C156.2 R192.1
NetC158_1: C158.1 R195.1 R196.2 U23.4(UVLO)
NetC159_2: C159.2 R197.2 U23.9(TMR)
NetQ13_4: Q13.4(G) U23.1(DGATE)
NetQ14_4: Q14.4(G) R192.2 U23.14(HGATE)
NetR195_2: R195.2 R200.2 U23.3(SW)
NetR199_2: R199.2 U23.11(ILIM)
NetR200_1: R200.1 R201.2 U23.5(OV)

Not connected (* = marked no-connect by the designer): U23 8(NC)* 17(NC)* 21(NC)* 25(EP_(NOT_GND))*

### Channels
OR_0: designators end in _OR_0; ports 3V3_IMON=3V3_CAR_VCC_I_SENSE 3V3_nFLT=3V3_PWR_nFLT 3V3_nINH=NetD13_OR_0_1 3V3_V_SENSE=3V3_CAR_VCC_V_SENSE HV_nSLEEP=HV_PWR_EN PWR_IN=CAR_VCC PWR_OUT=PRE_VCC
OR_1: designators end in _OR_1; ports 3V3_IMON=3V3_CAR_APM_I_SENSE 3V3_nFLT=3V3_PWR_nFLT 3V3_nINH=NetD13_OR_1_1 3V3_V_SENSE=3V3_CAR_APM_V_SENSE HV_nSLEEP=HV_PWR_EN PWR_IN=APM_VCC PWR_OUT=PRE_VCC

### Layout directives
net class PWR: CAR_VCC, LM74910H_VS_OR_0, NetC150_OR_0_2, PRE_VCC

### Notes on the sheet
- Chose ISC011N06LM5ATMA1 for:
  V_DS_MAX = 60V (Same as DS design, but smaller than 100V that I wanted)
  R_DS_ON = 1.15 mOhm (driver behind this choice, a little low for V-sense of LM74910H but probably acceptable)
  V_GS_MAX = +-20V (larger than 15V which is what LM74910H needs)
- RES+ZENER USED TO MAKE ORing CIRCUIT DEFAULT ON, CAN BE DNP
- These caps are intended to absorb HV transient pulses. There are likely too many so some can be DNP
- Do we really need/want output caps? If so maybe resize these
- Res value is arbitrary, but improves smootheness of system turn off. Cap above is to limit inrush current and also arbitrary. EQ on P19 of DS
- Can connect ILIM to GND and floar TMR if not using ILIM as per p20 of DS
- Placing 100k res in DNP above causes latch-off instead of auto-retry OC behaviour
- Operating input voltage range --> 12V nom w/ 3.2V cold crank and 35V load dump (idk so using same as DS)
  Output power --> 12V*20A=240W so ~250W
  Output current range --> 10A nom (guess), 20A peak
  Input capacitance --> .1u (mainly for this IC)
  Output capacitance --> 100u + 10u
  Short circuit current limit --> 15A
  Overcurrent limit --> 25A
  Overvoltage cutoff --> 17V
  Rsense = 3m +-1%
  Rset = 49.9 ~50 but idrk why. DS kinda vague here
  Rilim = 7.984k ~8.2k closest standard value, gives 24A ilim
  Rimon = 5.1k which gives ~2.76V at max current
  R1=R3=100k
  UV --> 5.5V --> R2=11.5k
  OV --> 17V --> R4=3.6k
- Schematics Checked - Dec 04 2025
  - Component connections as per Figure 9-1 of DS
  - Component values computed as per DS design guidelines
  - MOS selection good
- (in symbol CMP-05427-000030-1) +

### Library data of the parts
C147 = CMP-05427-000030-1: CAP ALUM 10UF 20% 50V SMD; Impedance: 1.52R; Ripple Current (AC): 85mA; Life (Hours): 2000Hour; Leakage Current: 3uA; Dielectric Material: Aluminium; Length: 5.8mm; Voltage Rating: 50V; Radiation Hardening: No; Max Operating Temperature: 105°C; REACH SVHC: No SVHC; Tolerance: 20%; RoHS Compliant: Yes; Case/Package: Radial; Height: 5.8mm; Voltage: 50V; Diameter: 5mm; Number of Pins: 2; Ripple Current: 85mA; Series: FK; Lead Free: Lead Free; Width: 6.5mm; ESR (Equivalent Series Resistance): 1.52R; Package Quantity: 1000; Construction: Cylindrical; Voltage Rating (DC): 50V; Packaging: Tape and Reel; Height - Seated (Max): 0.228inch; Contact Plating: Tin; Capacitance: 10uF; Min Operating Temperature: -55°C; Termination: SMD/SMT; Material: Aluminium; Mount: Surface Mount
C148 C149 = CMP-2000-05477-2: General Purpose Ceramic Capacitor, 1210, 10uF, 10%, X5R, 15%, 25V; Lead Free: Lead Free; Max Operating Temperature: 85°C; REACH SVHC: No SVHC; Depth: 2.5mm; Packaging: Tape and Reel; Min Operating Temperature: -55°C; Height: 2.29mm; Construction: Flat; Case Code (Imperial): 1210; Radiation Hardening: No; Voltage: 25V; Case/Package: 1210; Series: -; Dielectric: X5R; Length: 3.2mm; Thickness: 0.11inch; Package Quantity: 1; Termination: SMD/SMT; Case Code (Metric): 3225; Voltage Rating (DC): 25V; Voltage Rating: 25V; Contact Plating: Tin; RoHS Compliant: Yes; Mount: Surface Mount; Width: 0.098inch; Capacitance: 10uF; Tolerance: 10%
C150-C152 C156-C159 = CMP-001-00058-1: as C65 on sheet MAX96724_PINOUT; Min Operating Temperature: -55°C; Mounting Technology: Surface Mount; Pins: 2; Case/Package: 0402; RoHS Compliant: Yes; Max Operating Temperature: 85°C
C153-C155 = CMP-03422-000642-1: CAP CER 0.1UF 100V X7R 1210; Manufacturer: Yageo; Automotive Grade: Grade 1; Capacitance: 100 nF; Material: Ceramic; Value: 100 nF; Temperature Coefficient: 15%; Tolerance: 0.1; Automotive: Yes; ComponentLink2Description: Datasheet; Device Class L2: Capacitors; Height: 0.95mm; Manufacturer Part Number: AC1210KKX7R0BB104; Temperature: -55°C to +125°C; Voltage Rating: 100 V; Device Class L1: Passive Components; ComponentLink2URL: http://www.yageo.com/documents/recent/UPY-AC_NP0X7R_16V-to-630V_12.pdf; Lead Free: Yes; Category: Cap; Temperature Range High: +125°C; RoHS: TRUE; Digikey Description: CAP CER 0.1UF 100V X7R 1210; Temperature Range Low: -55°C; Octopart: https://octopart.com/ac1210kkx7r0bb104-yageo-78873719; Device Class L3: Ceramic Capacitors; Ipc Land Pattern Name: CAPC320250X85; Package: AC1210-0.85; Footprint Url: http://www.yageo.com/exep/pages/download/literatures/UPY-C_GEN_24.pdf; Temperature Characteristic: X7R
D11 D13 D14 = CMP-1060-00750-1: Zener Voltage Regulator, 500 mW, 2-Pin SOD-523, Pb-Free, Tape and Reel; Manufacturer: On Semiconductor; P Max (W): 0.5; VZ Typ (V): 3.3; RoHS: Pb-Free; ComponentLink2Description: Datasheet; PackageReference: SOD-523-2-502-01; DatasheetVersion: Rev. 10; ComponentLink1Description: Manufacturer URL; PackageVersion: Rev. E, 09/2010; ComponentLink3URL: http://www.onsemi.com/pub_link/Collateral/502-01.PDF; ComponentLink2URL: http://www.onsemi.cn/pub_link/Collateral/MM5Z2V4T1-D.PDF; Mounting Technology: Surface Mount; PartNumber: MM5Z3V3T1G; Packing: Tape and Reel; PackageDescription: 2-Pin SOD, Body 1.2 x 0.8 mm; ComponentLink1URL: http://www.onsemi.com/; ComponentLink3Description: Package Specification
D12 = CMP-12225-000040-1: TVS DIODE 33V 69.7V SMB; Manufacturer: STMicroelectronics; Direction: Bidirectional; Peak Pulse Current: 11.8A; Peak Pulse Power: 600W; Clamping Voltage: 53.3V; Breakdown Voltage: 36.7V; Number Of Channels: 1; Standoff Height: 0.05mm; Max Junction Temp: +150°C; Lead Free: Yes; Device Class L1: Circuit Protection; Device Class L3: unset; Mouser Description: TVS Diodes - Transient Voltage Suppressors 600W 33V Bidirect; Device Class L2: TVS Diodes; Temperature Range High: +150°C; Temperature: -55°C to +150°C; Temperature Range Low: -55°C; Octopart: https://octopart.com/smbj33ca-tr-stmicroelectronics-347069; Manufacturer Part Number: SMBJ33CA-TR; Automotive: No; ComponentLink2URL: https://www.st.com/resource/en/datasheet/smbj.pdf; RoHS: TRUE; Package: SMB-CA; Category: Diode; ComponentLink2Description: Datasheet; Height: 2.65mm; Reverse Standoff Voltage: 33V; Digikey Description: TVS DIODE 33V 69.7V SMB
Q13 Q14 = CMP-32901-001049-1: TRENCH 40<-<100V PG-TDSON-8
R187 R188 R190-R201 = CMP-009-00002-14: Resistor
R189 = CMP-00597-24927456-1: KRL6432E-M-R003-F-T1 Metal Foil Low Resistance Chip Resistor (long-side terminal), 2512, RoHS; Tolerance: 1%; Resistance: 3mΩ; Temperature Coefficient: 50ppm/°C; Power Rating: 3W; Height: 700µm; NexarPartId: 24927456; Termination: SMD/SMT; Case Code (Metric): 6432; Min Operating Temperature: -55°C; Length: 3.1mm; Weight: 40.511469mg; Width: 6.3mm; Lifecycle Status: Production; Max Operating Temperature: 155°C; Case Code (Imperial): 2512; Composition: Metal Foil; Case/Package: 2512; Max Thickness: 700µm; RoHS: Compliant
U23 = CMP-019-00057-2: Automotive ideal diode with circuit breaker, 200-kHz ACS, UV , OV protection and SLEEP mode 24-VQFN -40 to 125; Pins: 24; Case/Package: VQFN